# EAGLE board CPU68K_v3.2.1 (EAGLE 5.06)
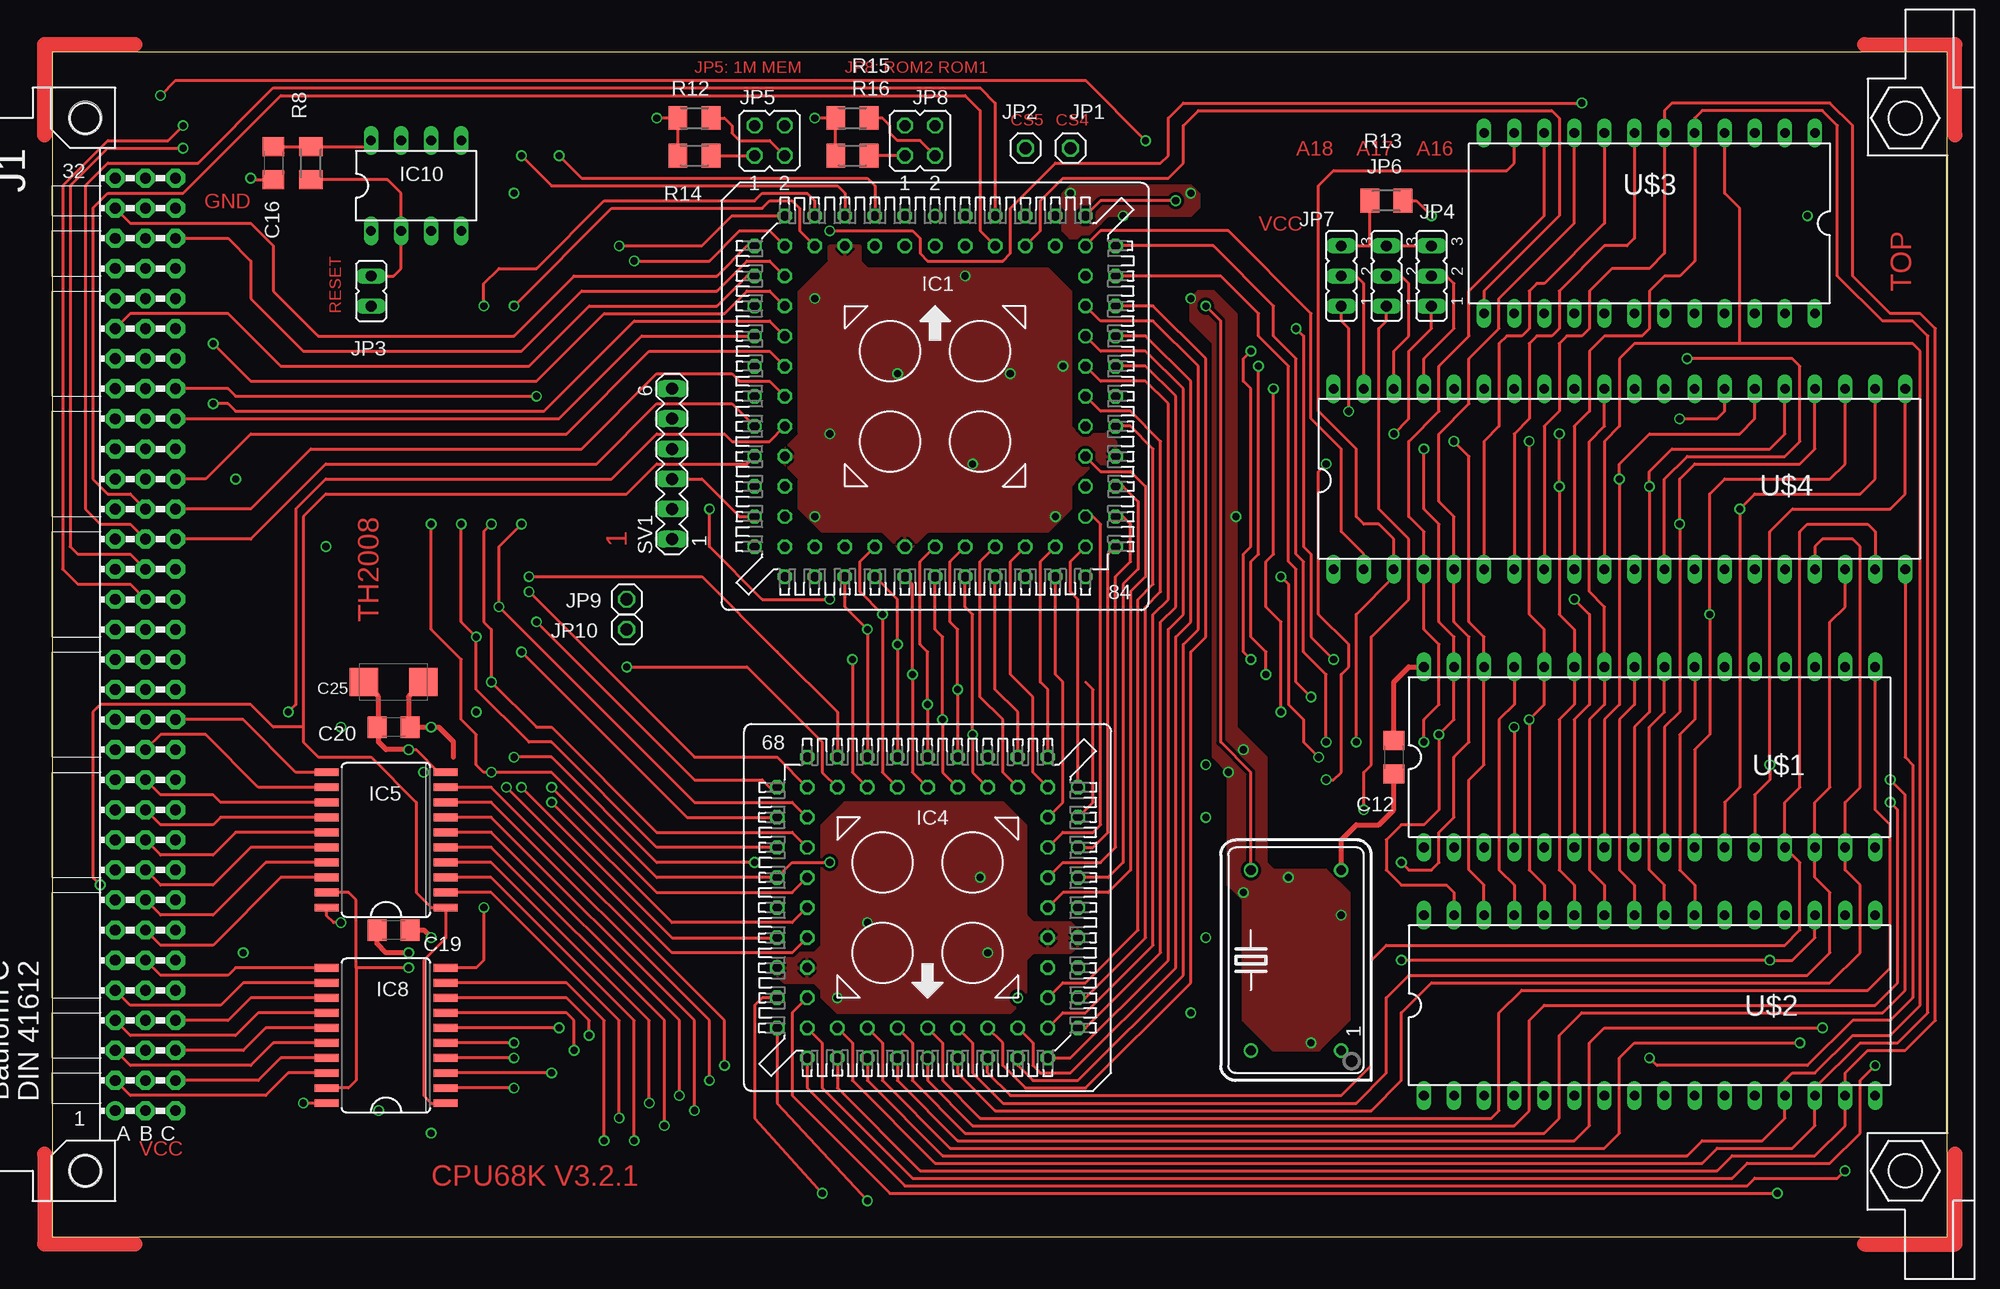
[diagram p1: board, top side]
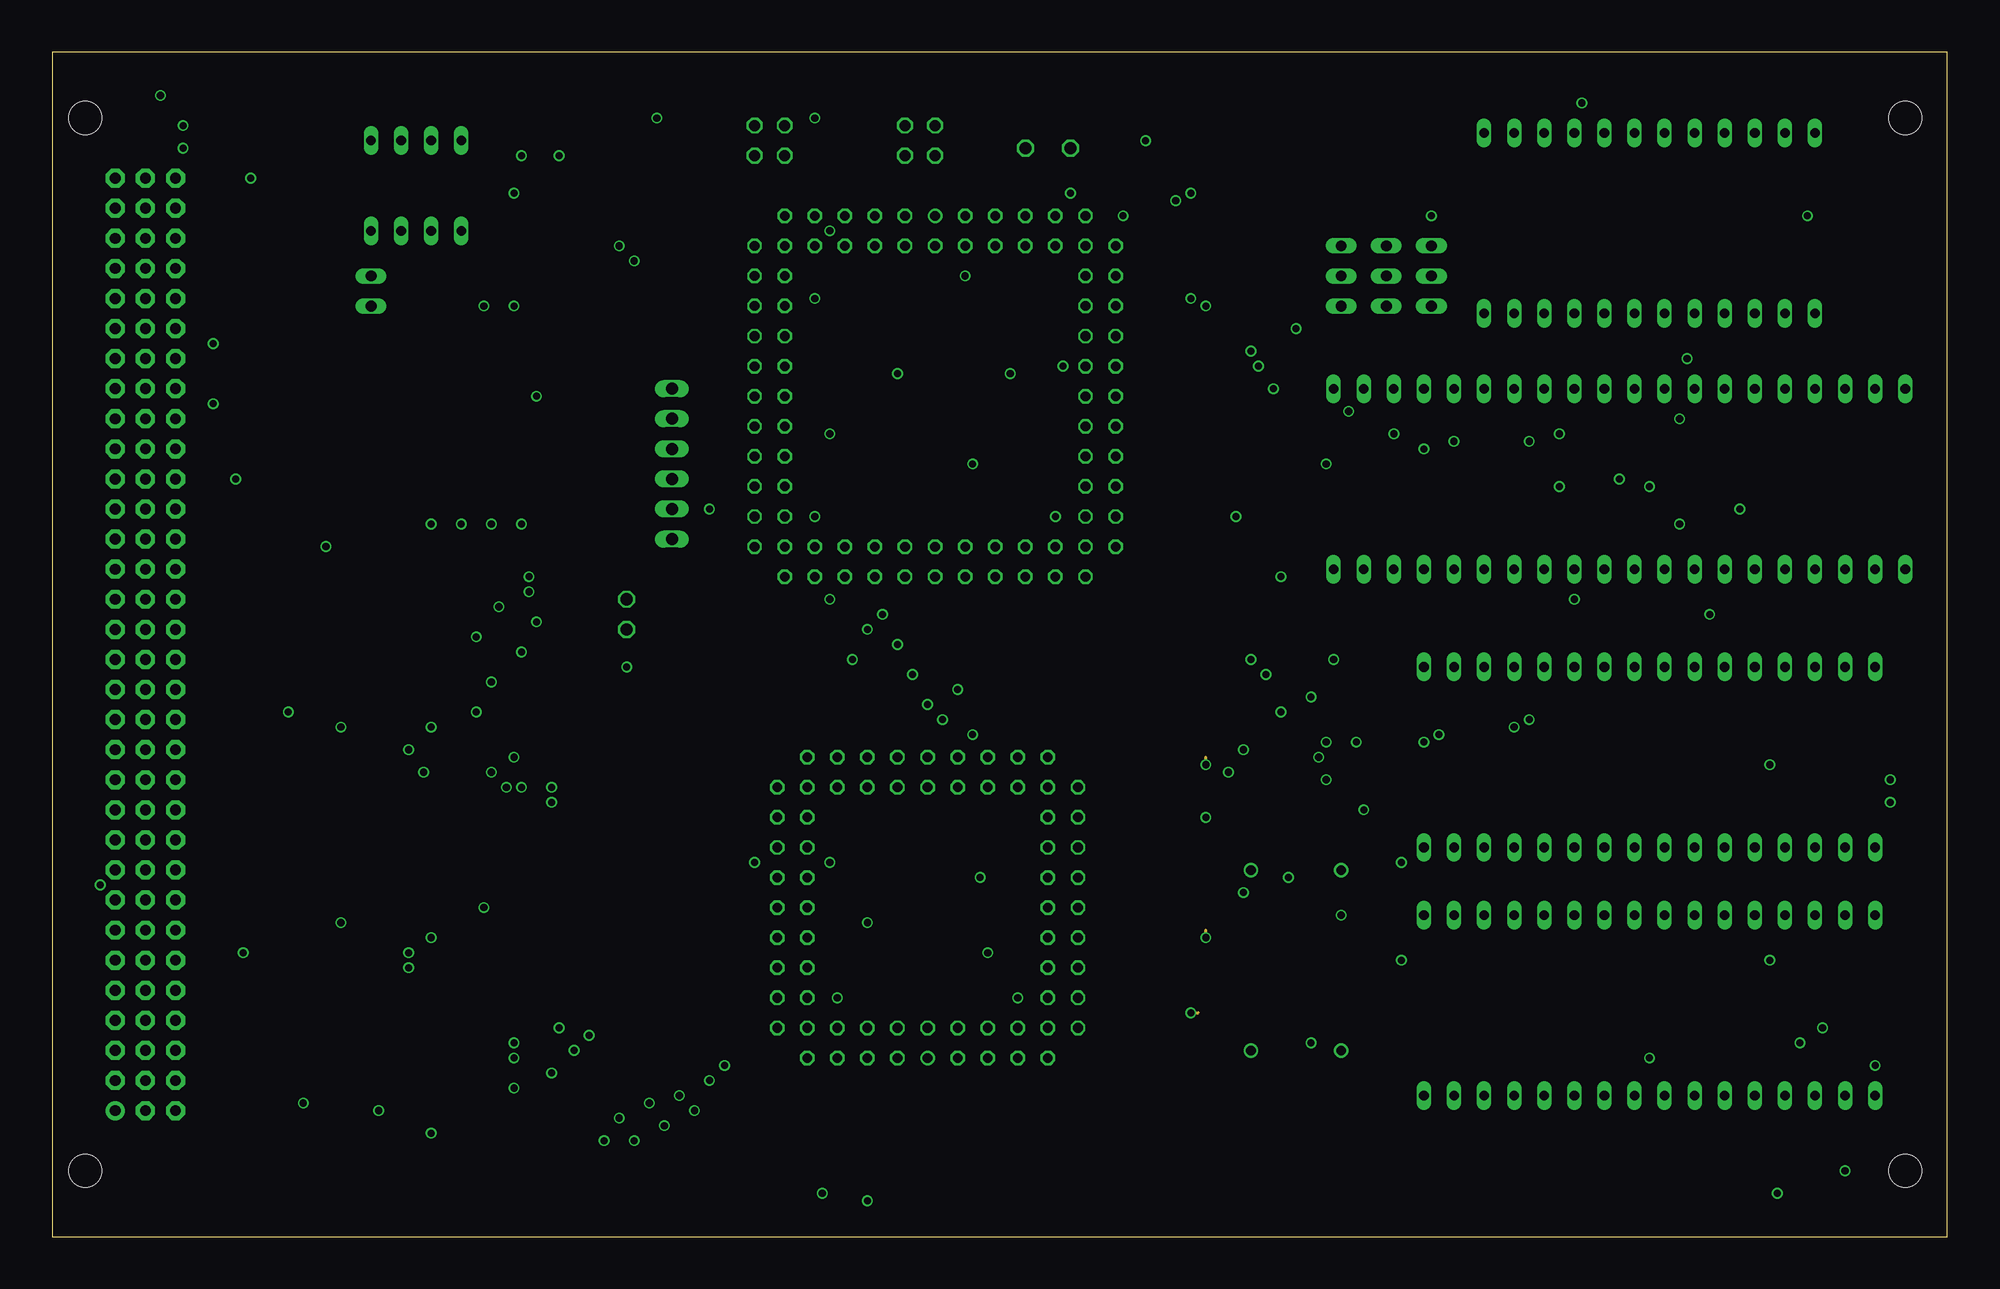
[diagram p2: board, inner layer $GND]
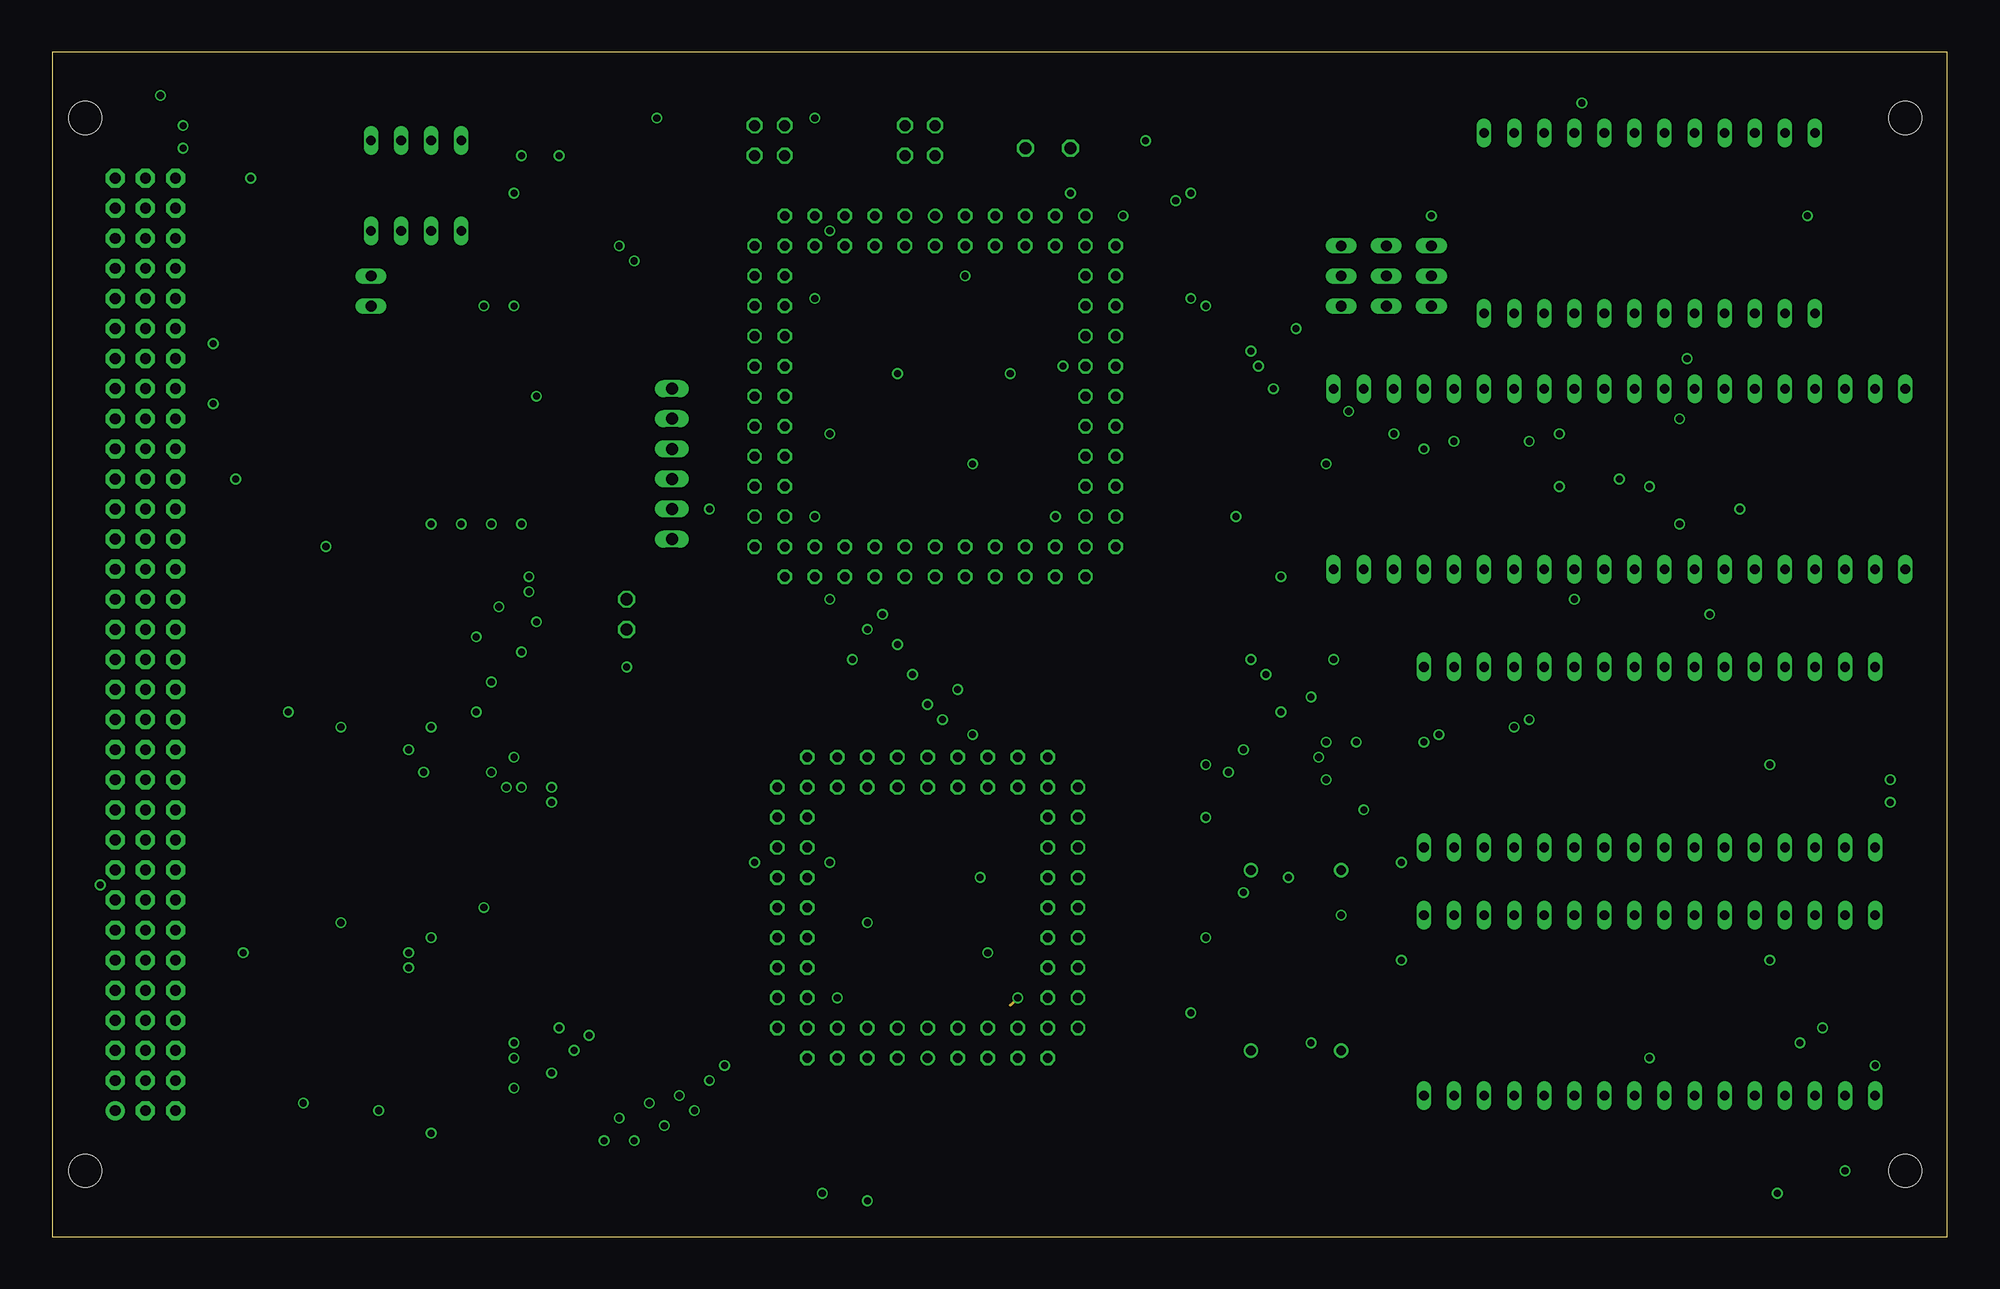
[diagram p3: board, inner layer $VCC]
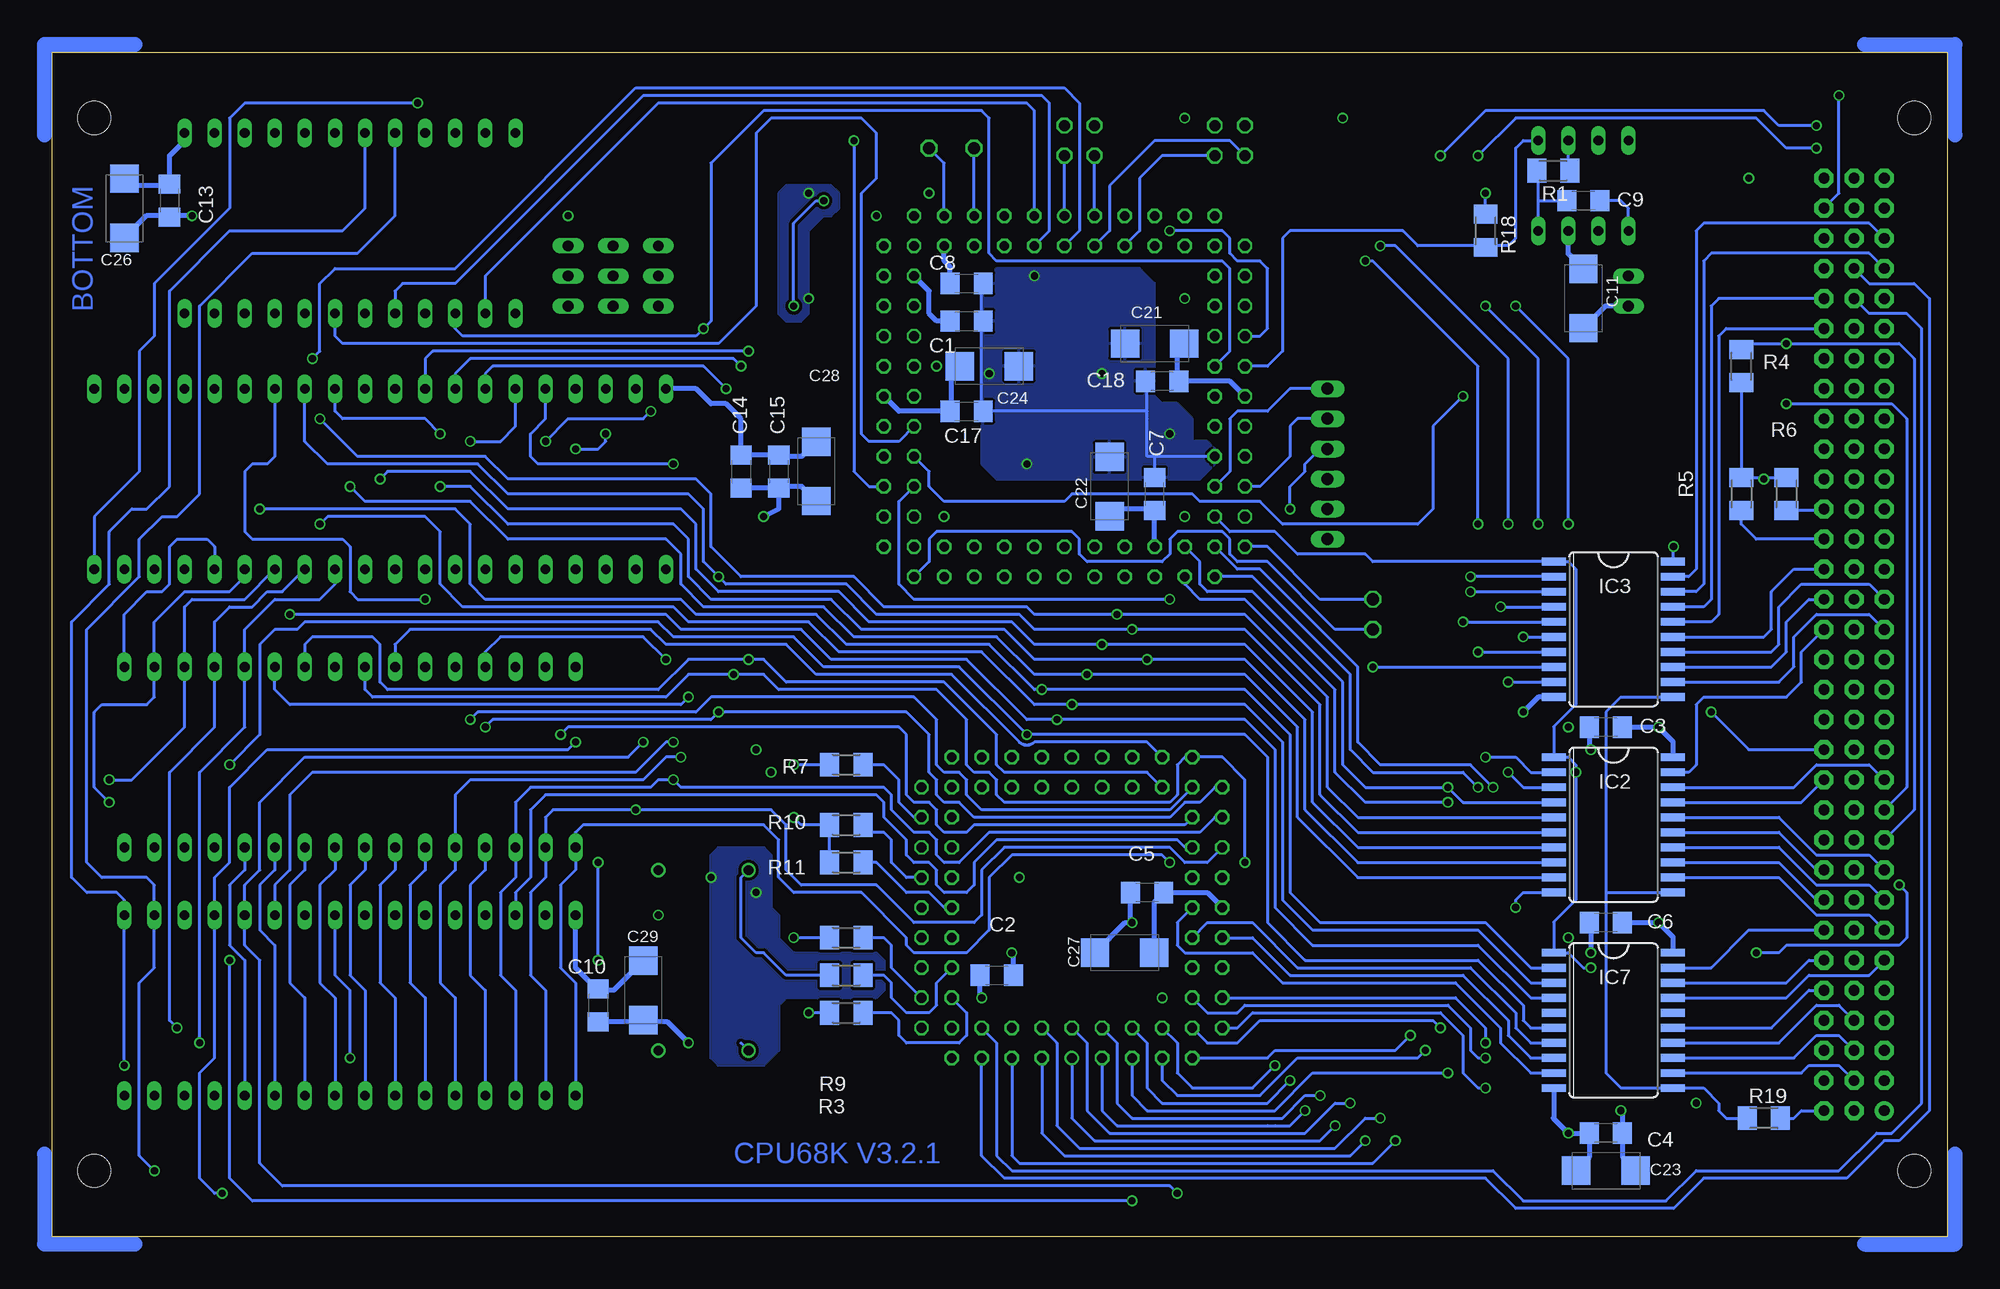
[diagram p4: board, bottom side, seen from below]

Size 160.02 x 100.03 mm. Coordinates in mm from the lower left corner, seen from the top.
Copper layers (1*2*3*16): Top 0.035mm / dielectric 1.5mm / $GND 0.035mm / dielectric 0.15mm / $VCC 0.035mm / dielectric 0.2mm / Bottom 0.035mm
Design rules "PCB-POOL": minimum track width 6mil, minimum drill 12mil, track to track 6mil, track to pad 6mil, pad to pad 6mil, via to via 6mil, smd to smd 6mil, copper to edge 20mil, drill to drill 8mil, minimum pad ring 8mil, minimum via ring 6mil, stop-mask expansion 3mil, vias tented up to drill 0mil, thermal gap 8mil

## Footprints (pad centres in the part's own frame; a part is rotated, then mirrored left to right if it is on the bottom)
C1206 = smd 1.6 x 1.8: 1 -1.4,0; 2 1.4,0
SMC_C = smd 2.4 x 2.4: + -2.5,0; - 2.5,0
S84 = drill 0.813 round: 1 0,15.24 | drill 0.813 octagon: 2 0,12.7; 3 -2.54,15.24; 4 -2.54,12.7; 5 -5.08,15.24; 6 -5.08,12.7; 7 -7.62,15.24; 8 -7.62,12.7; 9 -10.16,15.24; 10 -10.16,12.7; 11 -12.7,15.24; 12 -15.24,12.7; 13 -12.7,12.7; 14 -15.24,10.16; 15 -12.7,10.16; 16 -15.24,7.62; 17 -12.7,7.62; 18 -15.24,5.08; 19 -12.7,5.08; 20 -15.24,2.54; 21 -12.7,2.54; 22 -15.24,0; 23 -12.7,0; 24 -15.24,-2.54; 25 -12.7,-2.54; 26 -15.24,-5.08; 27 -12.7,-5.08; 28 -15.24,-7.62; 29 -12.7,-7.62; 30 -15.24,-10.16; 31 -12.7,-10.16; 32 -15.24,-12.7; 33 -12.7,-15.24; 34 -12.7,-12.7; 35 -10.16,-15.24; 36 -10.16,-12.7; 37 -7.62,-15.24; 38 -7.62,-12.7; 39 -5.08,-15.24; 40 -5.08,-12.7; 41 -2.54,-15.24; 42 -2.54,-12.7; 43 0,-15.24; 44 0,-12.7; 45 2.54,-15.24; 46 2.54,-12.7; 47 5.08,-15.24; 48 5.08,-12.7; 49 7.62,-15.24; 50 7.62,-12.7; 51 10.16,-15.24; 52 10.16,-12.7; 53 12.7,-15.24; 54 15.24,-12.7; 55 12.7,-12.7; 56 15.24,-10.16; 57 12.7,-10.16; 58 15.24,-7.62; 59 12.7,-7.62; 60 15.24,-5.08; 61 12.7,-5.08; 62 15.24,-2.54; 63 12.7,-2.54; 64 15.24,0; 65 12.7,0; 66 15.24,2.54; 67 12.7,2.54; 68 15.24,5.08; 69 12.7,5.08; 70 15.24,7.62; 71 12.7,7.62; 72 15.24,10.16; 73 12.7,10.16; 74 15.24,12.7; 75 12.7,15.24; 76 12.7,12.7; 77 10.16,15.24; 78 10.16,12.7; 79 7.62,15.24; 80 7.62,12.7; 81 5.08,15.24; 82 5.08,12.7; 83 2.54,15.24; 84 2.54,12.7
SO20W = smd 0.66 x 2.032: 1 -5.715,-5.029; 2 -4.445,-5.029; 3 -3.175,-5.029; 4 -1.905,-5.029; 5 -0.635,-5.029; 6 0.635,-5.029; 7 1.905,-5.029; 8 3.175,-5.029; 9 4.445,-5.029; 10 5.715,-5.029; 11 5.715,5.029; 12 4.445,5.029; 13 3.175,5.029; 14 1.905,5.029; 15 0.635,5.029; 16 -0.635,5.029; 17 -1.905,5.029; 18 -3.175,5.029; 19 -4.445,5.029; 20 -5.715,5.029
PLCC68-S = drill 0.813 round: 1 0,12.7 | drill 0.813 octagon: 2 0,10.16; 3 -2.54,12.7; 4 -2.54,10.16; 5 -5.08,12.7; 6 -5.08,10.16; 7 -7.62,12.7; 8 -7.62,10.16; 9 -10.16,12.7; 10 -12.7,10.16; 11 -10.16,10.16; 12 -12.7,7.62; 13 -10.16,7.62; 14 -12.7,5.08; 15 -10.16,5.08; 16 -12.7,2.54; 17 -10.16,2.54; 18 -12.7,0; 19 -10.16,0; 20 -12.7,-2.54; 21 -10.16,-2.54; 22 -12.7,-5.08; 23 -10.16,-5.08; 24 -12.7,-7.62; 25 -10.16,-7.62; 26 -12.7,-10.16; 27 -10.16,-12.7; 28 -10.16,-10.16; 29 -7.62,-12.7; 30 -7.62,-10.16; 31 -5.08,-12.7; 32 -5.08,-10.16; 33 -2.54,-12.7; 34 -2.54,-10.16; 35 0,-12.7; 36 0,-10.16; 37 2.54,-12.7; 38 2.54,-10.16; 39 5.08,-12.7; 40 5.08,-10.16; 41 7.62,-12.7; 42 7.62,-10.16; 43 10.16,-12.7; 44 12.7,-10.16; 45 10.16,-10.16; 46 12.7,-7.62; 47 10.16,-7.62; 48 12.7,-5.08; 49 10.16,-5.08; 50 12.7,-2.54; 51 10.16,-2.54; 52 12.7,0; 53 10.16,0; 54 12.7,2.54; 55 10.16,2.54; 56 12.7,5.08; 57 10.16,5.08; 58 12.7,7.62; 59 10.16,7.62; 60 12.7,10.16; 61 10.16,12.7; 62 10.16,10.16; 63 7.62,12.7; 64 7.62,10.16; 65 5.08,12.7; 66 5.08,10.16; 67 2.54,12.7; 68 2.54,10.16
DIL08 = drill 0.813 long: 1 -3.81,-3.81; 2 -1.27,-3.81; 3 1.27,-3.81; 4 3.81,-3.81; 5 3.81,3.81; 6 1.27,3.81; 7 -1.27,3.81; 8 -3.81,3.81
VG96P = drill 0.914 pad 1.6 round: A1 154.94,39.37 | drill 0.914 pad 1.6 octagon: A2 154.94,36.83; A3 154.94,34.29; A4 154.94,31.75; A5 154.94,29.21; A6 154.94,26.67; A7 154.94,24.13; A8 154.94,21.59; A9 154.94,19.05; A10 154.94,16.51; A11 154.94,13.97; A12 154.94,11.43; A13 154.94,8.89; A14 154.94,6.35; A15 154.94,3.81; A16 154.94,1.27; A17 154.94,-1.27; A18 154.94,-3.81; A19 154.94,-6.35; A20 154.94,-8.89; A21 154.94,-11.43; A22 154.94,-13.97; A23 154.94,-16.51; A24 154.94,-19.05; A25 154.94,-21.59; A26 154.94,-24.13; A27 154.94,-26.67; A28 154.94,-29.21; A29 154.94,-31.75; A30 154.94,-34.29; A31 154.94,-36.83; A32 154.94,-39.37; B1 152.4,39.37; B2 152.4,36.83; B3 152.4,34.29; B4 152.4,31.75; B5 152.4,29.21; B6 152.4,26.67; B7 152.4,24.13; B8 152.4,21.59; B9 152.4,19.05; B10 152.4,16.51; B11 152.4,13.97; B12 152.4,11.43; B13 152.4,8.89; B14 152.4,6.35; B15 152.4,3.81; B16 152.4,1.27; B17 152.4,-1.27; B18 152.4,-3.81; B19 152.4,-6.35; B20 152.4,-8.89; B21 152.4,-11.43; B22 152.4,-13.97; B23 152.4,-16.51; B24 152.4,-19.05; B25 152.4,-21.59; B26 152.4,-24.13; B27 152.4,-26.67; B28 152.4,-29.21; B29 152.4,-31.75; B30 152.4,-34.29; B31 152.4,-36.83; B32 152.4,-39.37; C1 149.86,39.37; C2 149.86,36.83; C3 149.86,34.29; C4 149.86,31.75; C5 149.86,29.21; C6 149.86,26.67; C7 149.86,24.13; C8 149.86,21.59; C9 149.86,19.05; C10 149.86,16.51; C11 149.86,13.97; C12 149.86,11.43; C13 149.86,8.89; C14 149.86,6.35; C15 149.86,3.81; C16 149.86,1.27; C17 149.86,-1.27; C18 149.86,-3.81; C19 149.86,-6.35; C20 149.86,-8.89; C21 149.86,-11.43; C22 149.86,-13.97; C23 149.86,-16.51; C24 149.86,-19.05; C25 149.86,-21.59; C26 149.86,-24.13; C27 149.86,-26.67; C28 149.86,-29.21; C29 149.86,-31.75; C30 149.86,-34.29; C31 149.86,-36.83; C32 149.86,-39.37 | hole 2.794: 3.81,44.45; 3.81,-44.45; 157.48,44.45; 157.48,-44.45
1X01 = drill 1.016 octagon: 1 0,0
JP1 = drill 0.914 long: 1 0,-1.27; 2 0,1.27
JP2 = drill 0.914 long: 1 -2.54,0; 2 0,0; 3 2.54,0
JP2Q = drill 0.914 octagon: 1 -1.27,-1.27; 2 -1.27,1.27; 3 1.27,-1.27; 4 1.27,1.27
DIL14S = drill 0.813 round: 1 -7.62,-3.81; 7 7.62,-3.81; 8 7.62,3.81; 14 -7.62,3.81
M1206 = smd 1.6 x 2: 1 -1.4,0; 2 1.4,0
MA06-1 = drill 1.016 long: 1 -6.35,0; 2 -3.81,0; 3 -1.27,0; 4 1.27,0; 5 3.81,0; 6 6.35,0
DIL32 = drill 0.813 long: 1 -19.05,-7.62; 2 -16.51,-7.62; 3 -13.97,-7.62; 4 -11.43,-7.62; 5 -8.89,-7.62; 6 -6.35,-7.62; 7 -3.81,-7.62; 8 -1.27,-7.62; 9 1.27,-7.62; 10 3.81,-7.62; 11 6.35,-7.62; 12 8.89,-7.62; 13 11.43,-7.62; 14 13.97,-7.62; 15 16.51,-7.62; 16 19.05,-7.62; 17 19.05,7.62; 18 16.51,7.62; 19 13.97,7.62; 20 11.43,7.62; 21 8.89,7.62; 22 6.35,7.62; 23 3.81,7.62; 24 1.27,7.62; 25 -1.27,7.62; 26 -3.81,7.62; 27 -6.35,7.62; 28 -8.89,7.62; 29 -11.43,7.62; 30 -13.97,7.62; 31 -16.51,7.62; 32 -19.05,7.62
DIL24 = drill 0.813 long: 1 -13.97,-7.62; 2 -11.43,-7.62; 3 -8.89,-7.62; 4 -6.35,-7.62; 5 -3.81,-7.62; 6 -1.27,-7.62; 7 1.27,-7.62; 8 3.81,-7.62; 9 6.35,-7.62; 10 8.89,-7.62; 11 11.43,-7.62; 12 13.97,-7.62; 13 13.97,7.62; 14 11.43,7.62; 15 8.89,7.62; 16 6.35,7.62; 17 3.81,7.62; 18 1.27,7.62; 19 -1.27,7.62; 20 -3.81,7.62; 21 -6.35,7.62; 22 -8.89,7.62; 23 -11.43,7.62; 24 -13.97,7.62
DIL40 = drill 0.813 long: 1 -24.13,-7.62; 2 -21.59,-7.62; 3 -19.05,-7.62; 4 -16.51,-7.62; 5 -13.97,-7.62; 6 -11.43,-7.62; 7 -8.89,-7.62; 8 -6.35,-7.62; 9 -3.81,-7.62; 10 -1.27,-7.62; 11 1.27,-7.62; 12 3.81,-7.62; 13 6.35,-7.62; 14 8.89,-7.62; 15 11.43,-7.62; 16 13.97,-7.62; 17 16.51,-7.62; 18 19.05,-7.62; 19 21.59,-7.62; 20 24.13,-7.62; 21 24.13,7.62; 22 21.59,7.62; 23 19.05,7.62; 24 16.51,7.62; 25 13.97,7.62; 26 11.43,7.62; 27 8.89,7.62; 28 6.35,7.62; 29 3.81,7.62; 30 1.27,7.62; 31 -1.27,7.62; 32 -3.81,7.62; 33 -6.35,7.62; 34 -8.89,7.62; 35 -11.43,7.62; 36 -13.97,7.62; 37 -16.51,7.62; 38 -19.05,7.62; 39 -21.59,7.62; 40 -24.13,7.62

## Placement (x,y rotation side)
C1  100n  [C1206]  82.8,77.32 0 bottom
C2  100n  [C1206]  80.26,22.07 0 bottom
C3  100n  [C1206]  28.83,43.03 180 bottom
C4  100n  [C1206]  28.83,8.74 180 bottom
C5  100n  [C1206]  67.56,29.06 180 bottom
C6  100n  [C1206]  28.83,26.52 180 bottom
C7  100n  [C1206]  66.93,62.71 90 bottom
C8  100n  [C1206]  82.8,80.49 0 bottom
C9  100n  [C1206]  30.73,87.48 180 bottom
C10  100n  [C1206]  113.92,19.53 270 bottom
C11  10µ/16  [SMC_C]  30.73,79.22 270 bottom
C12  100n  [C1206]  113.28,40.49 270 top
C13  100n  [C1206]  150.11,87.48 270 bottom
C14  100n  [C1206]  101.85,64.62 270 bottom
C15  100n  [C1206]  98.68,64.62 270 bottom
C16  100n  [C1206]  18.67,90.65 270 top
C17  100n  [C1206]  82.8,69.7 0 bottom
C18  100n  [C1206]  66.29,72.24 180 bottom
C19  100n  [C1206]  28.83,25.88 180 top
C20  100n  [C1206]  28.83,43.03 180 top
C21  10µ/16  [SMC_C]  66.93,75.41 180 bottom
C22  10µ/16  [SMC_C]  70.74,63.35 90 bottom
C23  10µ/16  [SMC_C]  28.83,5.56 180 bottom
C24  10µ/16  [SMC_C]  80.9,73.51 0 bottom
C25  10µ/16  [SMC_C]  28.83,46.84 180 top
C26  10µ/16  [SMC_C]  153.92,86.84 270 bottom
C27  10µ/16  [SMC_C]  69.47,23.98 180 bottom
C28  10µ/16  [SMC_C]  95.5,64.62 270 bottom
C29  10µ/16  [SMC_C]  110.11,20.8 270 bottom
IC1  XC9572PLCC84  [S84]  74.55,70.97 0 top
IC2  74HCT573D  [SO20W]  28.19,34.77 270 bottom
IC3  74HCT573D  [SO20W]  28.19,51.28 270 bottom
IC4  MC68HC001  [PLCC68-S]  73.91,27.79 180 top
IC5  74HCT245DW  [SO20W]  28.19,33.5 90 top
IC7  74HCT573D  [SO20W]  28.19,18.26 270 bottom
IC8  74HCT245DW  [SO20W]  28.19,16.99 90 top
IC10  TLC7725D  [DIL08]  30.73,88.75 0 top
J1  [VG96P]  160.27,50.01 180 top
JP1  [1X01]  85.98,91.92 0 top
JP2  [1X01]  82.17,91.92 0 top
JP3  RESET  [JP1]  26.92,79.86 0 top
JP4  [JP2]  116.46,81.13 90 top
JP5  [JP2Q]  60.58,92.56 0 top
JP6  [JP2]  112.65,81.13 90 top
JP7  [JP2]  108.84,81.13 90 top
JP8  [JP2Q]  73.28,92.56 0 top
JP9  [1X01]  48.51,53.82 0 top
JP10  [1X01]  48.51,51.28 0 top
QG1  [DIL14S]  105.03,23.34 90 top
R1  10k  [M1206]  33.27,90.02 180 bottom
R2  4k7  [M1206]  92.96,25.25 180 bottom
R3  4k7  [M1206]  92.96,18.9 180 bottom
R4  10k  [M1206]  17.4,73.51 270 bottom
R5  10k  [M1206]  17.4,62.71 90 bottom
R6  10k  [M1206]  13.59,62.71 90 bottom
R7  4k7  [M1206]  92.96,39.85 180 bottom
R8  10k  [M1206]  21.84,90.65 270 top
R9  47  [M1206]  92.96,22.07 180 bottom
R10  4k7  [M1206]  92.96,34.77 180 bottom
R11  3K3  [M1206]  92.96,31.6 180 bottom
R12  10k  [M1206]  54.23,94.46 180 top
R13  10k  [M1206]  112.65,87.48 0 top
R14  10k  [M1206]  54.23,91.29 180 top
R15  10k  [M1206]  67.56,94.46 180 top
R16  10k  [M1206]  67.56,91.29 180 top
R18  10k  [M1206]  38.99,84.94 270 bottom
R19  10k  [M1206]  15.49,10.01 0 bottom
SV1  [MA06-1]  52.32,65.25 90 top
U$1  628512PDIL32  [DIL32]  134.87,40.49 0 top
U$2  628512PDIL32  [DIL32]  134.87,19.53 0 top
U$3  DS12C887DIL24  [DIL24]  134.87,85.57 180 top
U$4  27C4002DIL40  [DIL40]  132.33,63.98 0 top

## Tracks (layer width: path | path; a pad name or v marks a point on that pad's centre or on a via)
1M
  Top 0.254: R14.1 JP5.1
  Bottom 0.254: JP5.1 60.58,92.56 66.93,92.56 70.74,88.75 70.74,84.94 IC1.4
/AS
  Top 0.254: IC4.6 80.26,16.36 80.26,14.45 82.17,12.55 87.25,12.55 96.14,21.44 96.14,49.38 97.41,50.65 97.41,74.14 92.96,78.59 IC1.70
/BERR
  Top 0.254: IC4.24 87.88,36.68 87.88,46.2 87.25,46.84
  Bottom 0.254: IC4.24 87.25,35.41 88.52,36.68 88.52,38.58 89.79,39.85 R7.1
/BG
  Top 0.254: IC4.11 85.34,18.9 87.25,18.9 92.96,24.61 92.96,52.55 94.23,53.82 94.23,70.33 92.33,72.24 88.52,72.24 IC1.67
/BGACK
  Top 0.254: IC4.12 87.25,20.17 92.33,25.25 92.33,53.19 93.6,54.46 93.6,67.16 91.06,69.7 88.52,69.7 IC1.65
  Bottom 0.254: R2.1 89.79,25.25 89.15,24.61 89.15,22.71 IC4.12
/BR
  Top 0.254: IC4.13 85.34,21.44 87.25,21.44 91.69,25.88 91.69,53.82 92.96,55.09 92.96,66.52 91.06,68.43 IC1.62
  Bottom 0.254: IC4.13 82.8,18.9 82.8,16.99 83.44,16.36 87.88,16.36 88.52,16.99 88.52,18.26 89.15,18.9 R3.1 91.69,18.9
/BUSACK
  Top 0.254: J1.A31 6.6,85.57 16.76,85.57 18.67,83.67 18.67,79.86 22.48,76.05 38.99,76.05 44.07,81.13 56.13,81.13 58.67,83.67 IC1.12
/BUSRQ  (via drill 0.6)
  Top 0.254: v13.59,70.33 14.86,70.33 15.49,69.7 41.53,69.7 49.15,77.32 60.58,77.32 IC1.19
  Bottom 0.254: J1.A11 3.43,37.95 3.43,69.06 4.7,70.33 v13.59,70.33
/CS1
  Top 0.254: U$4.2 110.74,57.63 108.84,59.54 108.84,66.52 106.3,69.06 106.3,77.95 99.31,84.94 88.52,84.94 IC1.76
/CS2  (via drill 0.6)
  Top 0.254: v106.3,45.57 105.03,46.84 105.03,56.36 104.39,57 104.39,73.51 101.85,76.05 101.85,77.95 98.68,81.13 IC1.72
  Bottom 0.254: U$1.22 141.22,46.2 139.95,44.93 106.93,44.93 v106.3,45.57
/CS3  (via drill 0.6)
  Top 0.254: v107.57,41.76 107.57,47.47 105.66,49.38 105.66,57 105.03,57.63 105.03,74.14 103.12,76.05 103.12,78.59 98.04,83.67 IC1.74
  Bottom 0.254: U$2.22 141.22,29.69 139.95,30.96 139.95,37.31 138.05,39.22 110.74,39.22 108.2,41.76 v107.57,41.76
/CS4
  Bottom 0.254: JP1.1 84.71,90.65 IC1.77
/CS5
  Bottom 0.254: IC1.79 JP2.1
/CS6
  Top 0.254: U$3.13 120.9,79.86 127.25,86.21 127.25,94.46 126.62,95.1 96.77,95.1 95.5,93.83 95.5,90.65 94.23,89.38 85.34,89.38 83.44,87.48 83.44,84.94 IC1.80
/CS7
  Bottom 0.254: IC1.53 85.98,57 85.98,58.9 85.34,59.54 73.91,59.54 73.28,58.9 73.28,57.63 72.64,57 66.29,57 65.66,57.63 65.66,58.9 65.02,59.54 61.21,59.54 60.58,58.9 60.58,57.63 59.94,57 57.4,57 51.69,51.28 JP10.1
/CS8
  Bottom 0.254: IC1.32 57.4,58.27 52.96,53.82 JP9.1
/DTACK
  Top 0.254: IC4.10 87.25,17.63 93.6,23.98 93.6,51.92 94.87,53.19 94.87,70.97 92.33,73.51 IC1.66
/HALT  (via drill 0.6)
  Top 0.254: IC4.19 85.34,29.06 89.15,29.06 91.06,30.96 91.06,54.46 92.33,55.73 92.33,63.35 91.06,64.62 88.52,64.62 IC1.61 | J1.C25 14.86,71.6 15.49,70.97 v40.89,70.97
  Bottom 0.254: R11.1 90.42,31.6 87.88,29.06 85.98,29.06 84.71,27.79 IC4.19 | IC1.61 85.98,64.62 85.98,63.35 84.71,62.08 74.55,62.08 73.91,62.71 63.75,62.71 63.12,62.08 58.04,62.08 56.13,60.17 44.7,60.17 43.43,61.44 43.43,68.43 v40.89,70.97
/INT
  Top 0.254: J1.C21 16.76,61.44 21.84,66.52 44.7,66.52 51.05,72.87 57.4,72.87 58.04,72.24 60.58,72.24 IC1.23
  Bottom 0.254: R6.1 10.54,61.31 J1.C21
/IPL0
  Top 0.254: IC4.27 84.07,46.2 83.44,46.84 83.44,57 IC1.52
/IPL1
  Top 0.254: IC4.26 86.61,53.82 85.98,54.46 85.98,57 IC1.55
/IPL2
  Top 0.254: IC4.25 85.34,36.68 85.34,46.84 84.71,47.47 IC1.51
/LDS
  Top 0.254: IC4.8 82.8,16.36 82.8,14.45 83.44,13.82 85.98,13.82 94.87,22.71 94.87,50.65 96.14,51.92 96.14,72.24 92.33,76.05 IC1.68
  Bottom 0.254: IC4.8 80.26,16.36 80.26,6.83 78.99,5.56 38.35,5.56 35.81,3.02 23.75,3.02 21.21,5.56 9.14,5.56 5.97,8.74 4.7,8.74 2.16,11.28 2.16,76.68 3.43,77.95 6.6,77.95 J1.B28
/NMI
  Top 0.254: J1.C20 16.76,58.9 23.11,65.25 45.97,65.25 51.05,70.33 57.4,70.33 IC1.24
  Bottom 0.254: R5.1 17.4,60.17 16.13,58.9 J1.C20
/RES
  Bottom 0.254: IC10.5 35.81,92.56 36.45,91.92 36.45,84.3 37.08,83.67 38.99,83.67 44.7,83.67 45.97,84.94 55.5,84.94 56.13,84.3 56.13,74.78 57.4,73.51 IC1.20
  Bottom 0.406: 38.99,83.67 R18.2
/RESET  (via drill 0.6)
  Top 0.254: IC4.20 89.15,30.33 90.42,31.6 90.42,55.09 91.69,56.36 91.69,62.08 90.42,63.35 IC1.58 | v9.14,96.37 10.41,97.64 87.25,97.64 v92.33,92.56
  Bottom 0.254: IC4.20 87.88,30.33 89.15,31.6 89.15,33.5 89.79,34.14 91.06,34.14 91.69,35.41 R10.1 | J1.C31 9.14,88.11 v9.14,96.37 | v92.33,92.56 92.33,64.62 91.06,63.35 IC1.58
/RTC_INT
  Bottom 0.254: IC1.63 88.52,67.16 91.06,67.16 91.69,67.79 91.69,88.11 90.42,89.38 90.42,93.19 91.69,94.46 99.31,94.46 100.58,93.19 100.58,78.59 103.76,75.41 135.51,75.41 136.14,76.05 U$3.19
/UDS
  Top 0.254: IC4.7 81.53,14.45 82.8,13.18 86.61,13.18 95.5,22.07 95.5,50.01 96.77,51.28 96.77,73.51 92.96,77.32 88.52,77.32 IC1.71
  Bottom 0.254: IC4.7 81.53,6.83 79.63,4.93 38.99,4.93 36.45,2.39 23.11,2.39 20.57,4.93 8.51,4.93 5.33,8.1 4.06,8.1 1.52,10.64 1.52,79.22 2.79,80.49 6.6,80.49 J1.B29
/VMA
  Top 0.254: IC4.21 85.34,31.6 88.52,31.6 89.79,32.87 89.79,55.73 91.06,57 91.06,60.17 90.42,60.81 IC1.56
/VPA
  Top 0.254: IC4.23 85.34,34.14 87.88,34.14 88.52,34.77 88.52,60.17 87.88,60.81 IC1.57
/WAIT  (via drill 0.6)
  Top 0.254: v13.59,75.41 16.76,72.24 40.89,72.24 46.61,77.95 56.77,77.95 58.67,79.86 60.58,79.86 IC1.17
  Bottom 0.254: J1.A10 2.79,36.04 2.79,74.14 4.06,75.41 v13.59,75.41 17.4,75.41 R4.1
A1  (via drill 0.6)
  Top 0.254: IC1.45 77.09,53.19 77.72,52.55 v77.72,42.39 77.72,39.22 IC4.32 | U$4.21 156.46,62.71 155.19,61.44 146.94,61.44 145.03,59.54 v145.03,39.85 145.03,38.58 143.76,37.31 U$1.12
  Bottom 0.254: U$2.12 143.76,23.34 145.03,24.61 145.03,29.69 143.76,30.96 U$1.12 | v145.03,39.85 142.49,42.39 142.49,50.01 141.22,51.28 139.32,51.28 138.68,51.92 108.84,51.92 107.57,50.65 97.41,50.65 94.87,48.11 83.44,48.11 v77.72,42.39 59.31,42.39 57.4,40.49 57.4,26.52 54.23,23.34 39.62,23.34 35.81,19.53 35.81,18.26 35.18,17.63 IC7.6
A2  (via drill 0.6)
  Top 0.254: IC4.33 v76.45,46.2 76.45,51.28 75.82,51.92 75.82,57 IC1.46 | U$4.22 153.92,63.98 152.65,62.71 143.76,62.71 v142.49,61.44 142.49,37.95 141.22,36.68 U$1.11
  Bottom 0.254: U$2.11 141.22,24.61 142.49,25.88 142.49,29.69 141.22,30.96 U$1.11 | v142.49,61.44 125.98,61.44 124.71,60.17 124.71,55.09 123.44,53.82 106.93,53.82 105.66,52.55 95.5,52.55 92.96,50.01 80.9,50.01 77.09,46.2 v76.45,46.2 59.31,46.2 55.5,42.39 55.5,29.06 52.96,26.52 38.99,26.52 35.18,22.71 IC7.2
A3  (via drill 0.6)
  Top 0.254: IC1.43 74.55,51.28 75.18,50.65 v75.18,43.66 75.18,39.22 IC4.34 | U$4.23 151.38,65.25 150.11,63.98 141.22,63.98 139.95,62.71 v139.95,52.55 139.95,42.39 138.68,41.12 U$1.10
  Bottom 0.254: U$2.10 138.68,20.17 139.95,21.44 139.95,29.69 138.68,30.96 U$1.10 | v139.95,52.55 108.2,52.55 106.93,51.28 96.77,51.28 94.23,48.74 82.8,48.74 77.72,43.66 v75.18,43.66 59.31,43.66 56.77,41.12 56.77,27.79 53.59,24.61 39.62,24.61 35.18,20.17 IC7.4
A4  (via drill 0.6)
  Top 0.254: IC4.35 v73.91,44.93 73.91,49.38 73.28,50.01 73.28,57 IC1.44 | U$4.24 148.84,66.52 147.57,65.25 138.68,65.25 137.41,63.98 v137.41,60.17 137.41,44.3 136.14,43.03 U$1.9
  Bottom 0.254: U$2.9 136.14,20.17 137.41,21.44 137.41,29.69 136.14,30.96 U$1.9 | v137.41,60.17 136.78,60.81 128.52,60.81 127.25,59.54 127.25,55.09 125.35,53.19 107.57,53.19 106.3,51.92 96.14,51.92 93.6,49.38 81.53,49.38 77.09,44.93 v73.91,44.93 59.31,44.93 56.13,41.76 56.13,28.42 53.59,25.88 39.62,25.88 35.18,21.44 IC7.3
A5  (via drill 0.6)
  Top 0.254: IC1.41 72.64,55.09 v72.64,47.47 72.64,39.22 IC4.36 | U$4.25 146.3,67.79 145.03,66.52 136.78,66.52 134.87,64.62 v134.87,63.35 134.87,44.3 133.6,43.03 U$1.8
  Bottom 0.254: U$2.8 133.6,20.8 134.87,22.07 134.87,29.69 133.6,30.96 U$1.8 | v134.87,63.35 133.6,62.08 124.71,62.08 121.54,58.9 108.2,58.9 106.93,57.63 106.93,55.09 105.03,53.19 94.87,53.19 92.33,50.65 80.26,50.65 77.09,47.47 v72.64,47.47 59.31,47.47 54.86,43.03 54.86,35.41 49.78,30.33 IC2.9
A6  (via drill 0.6)
  Top 0.254: IC4.37 v71.37,50.01 71.37,53.82 IC1.39 | U$1.7 131.06,43.66 132.33,44.93 v132.33,63.98 132.33,65.25 134.87,67.79 142.49,67.79 143.76,69.06 U$4.26
  Bottom 0.254: U$2.7 131.06,20.17 132.33,21.44 132.33,29.69 131.06,30.96 U$1.7 | v132.33,63.98 131.7,64.62 124.71,64.62 121.54,61.44 106.93,61.44 105.66,60.17 105.66,56.36 103.76,54.46 93.6,54.46 91.06,51.92 78.99,51.92 77.09,50.01 v71.37,50.01 59.31,50.01 53.59,44.3 53.59,36.68 49.78,32.87 IC2.7
A7  (via drill 0.6)
  Top 0.254: IC1.40 68.2,57 68.2,54.46 v70.1,52.55 70.1,39.22 IC4.38 | v137.41,69.06 140.59,69.06 141.22,69.7 U$4.27 | U$1.6 128.52,43.66 129.79,44.93 129.79,52.55 v128.52,53.82
  Bottom 0.254: U$2.6 128.52,20.17 129.79,21.44 129.79,29.69 128.52,30.96 U$1.6 | v137.41,69.06 134.24,65.89 123.44,65.89 121.54,63.98 105.66,63.98 104.39,62.71 104.39,58.27 101.85,55.73 92.33,55.73 89.79,53.19 77.72,53.19 77.09,52.55 v70.1,52.55 59.31,52.55 52.32,45.57 52.32,37.95 49.78,35.41 IC2.5 | v128.52,53.82 134.24,53.82 134.87,54.46 134.87,58.27 135.51,58.9 143.13,58.9 143.76,59.54 143.76,64.62 143.13,65.25 141.86,65.25 141.22,65.89 U$4.27
A8  (via drill 0.6)
  Top 0.254: IC4.39 v68.83,51.28 66.93,53.19 IC1.37 | v103.76,55.73 104.39,55.09 104.39,44.93 105.66,43.66 105.66,41.76 v106.93,40.49
  Bottom 0.254: U$2.5 125.98,20.17 127.25,21.44 127.25,29.69 125.98,30.96 U$1.5 125.98,37.31 124.71,38.58 110.11,38.58 108.2,40.49 v106.93,40.49 | U$4.28 138.68,67.16 136.78,65.25 124.08,65.25 121.54,62.71 106.3,62.71 105.03,61.44 105.03,57 v103.76,55.73 103.12,55.09 92.96,55.09 90.42,52.55 78.36,52.55 77.09,51.28 v68.83,51.28 59.31,51.28 52.96,44.93 52.96,37.31 49.78,34.14 IC2.6
A9  (via drill 0.6)
  Top 0.254: IC4.40 67.56,39.22 v67.56,48.74 | U$2.27 128.52,29.69 127.25,30.96 127.25,43.66 128.52,44.93 U$1.27 128.52,51.28 127.25,52.55 v127.25,63.35 v127.25,67.79
  Bottom 0.254: v127.25,63.35 124.71,63.35 121.54,60.17 107.57,60.17 106.3,58.9 106.3,55.73 104.39,53.82 94.23,53.82 91.69,51.28 79.63,51.28 77.09,48.74 v67.56,48.74 59.31,48.74 54.23,43.66 54.23,36.04 49.78,31.6 IC2.8 | v127.25,67.79 128.52,69.06 135.51,69.06 136.14,69.7 U$4.29
A10  (via drill 0.6)
  Top 0.254: v40.26,55.73 54.86,55.73 61.21,49.38 66.29,44.3 IC4.41 | U$2.26 131.06,29.69 129.79,30.96 129.79,43.66 131.06,44.93 U$1.26 131.06,53.19 129.79,54.46 129.79,67.16 131.06,68.43 U$4.31
  Bottom 0.254: IC4.41 67.56,41.76 77.09,41.76 arc90 78.36,41.76 84.07,47.47 95.5,47.47 98.04,50.01 108.2,50.01 109.47,51.28 129.79,51.28 131.06,50.01 U$1.26 | IC3.2 v40.26,55.73
A11  (via drill 0.6)
  Top 0.254: IC4.42 65.02,39.22 65.02,41.76 58.67,48.11 v48.51,48.11 | U$2.23 138.68,29.69 137.41,30.96 137.41,42.39 138.68,43.66 U$1.23 | v101.22,48.74 100.58,49.38 100.58,57.63 101.22,58.27 101.22,71.6 100.58,72.24 100.58,74.14 v101.22,74.78
  Bottom 0.254: IC4.42 67.56,39.22 79.63,39.22 80.26,39.85 80.26,42.39 84.71,46.84 98.04,46.84 99.95,48.74 v101.22,48.74 106.3,48.74 108.84,46.2 131.7,46.2 132.33,46.84 132.33,50.01 132.97,50.65 138.05,50.65 138.68,50.01 U$1.23 | v101.22,74.78 127.89,74.78 128.52,74.14 U$4.32 | v48.51,48.11 IC3.8
A12  (via drill 0.6)
  Top 0.254: v38.99,40.49 42.16,40.49 51.05,31.6 v59.31,31.6 | U$2.25 133.6,29.69 132.33,30.96 132.33,43.66 133.6,44.93 U$1.25 | v102.49,47.47 102.49,49.38 101.22,50.65 101.22,57 101.85,57.63 v101.85,73.51
  Bottom 0.254: v38.99,40.49 36.45,40.49 35.18,39.22 IC2.2 | v59.31,31.6 59.31,38.58 61.21,40.49 IC4.43 64.39,40.49 65.02,39.85 65.02,37.31 65.66,36.68 79.63,36.68 80.26,37.31 80.26,38.58 80.9,39.22 82.17,39.22 82.8,39.85 82.8,43.66 85.34,46.2 98.68,46.2 99.95,47.47 v102.49,47.47 106.3,47.47 108.2,45.57 132.97,45.57 133.6,46.2 U$1.25 | U$4.33 125.98,72.87 124.71,74.14 102.49,74.14 v101.85,73.51
A13  (via drill 0.6)
  Top 0.254: IC4.44 60.58,37.95 59.94,38.58 54.23,38.58 v40.89,51.92 | v123.44,43.03 U$1.4 | v103.76,44.3 103.76,51.92 102.49,53.19 102.49,57 103.12,57.63 v103.12,71.6
  Bottom 0.254: IC4.44 61.85,37.95 63.12,36.68 64.39,36.68 65.66,35.41 82.17,35.41 83.44,36.68 84.71,36.68 85.34,37.31 85.34,38.58 85.98,39.22 85.98,42.39 87.88,44.3 v103.76,44.3 104.39,43.66 122.81,43.66 v123.44,43.03 | U$2.4 123.44,20.8 124.71,22.07 124.71,29.69 123.44,30.96 U$1.4 | U$4.34 123.44,72.87 122.81,73.51 105.03,73.51 v103.12,71.6 | v40.89,51.92 IC3.5
A14  (via drill 0.6)
  Top 0.254: IC4.45 61.21,40.49 54.23,40.49 v40.26,54.46 | U$2.28 125.98,29.69 124.71,30.96 v124.71,43.66 125.98,44.93 U$1.28 125.98,51.28 124.71,52.55 v124.71,67.16
  Bottom 0.254: IC4.45 65.66,36.04 81.53,36.04 82.8,37.31 82.8,38.58 83.44,39.22 84.71,39.22 85.34,39.85 85.34,43.66 87.25,45.57 104.39,45.57 105.66,44.3 124.08,44.3 v124.71,43.66 | v124.71,67.16 122.17,67.16 120.9,68.43 U$4.35 | v40.26,54.46 IC3.3
A15  (via drill 0.6)
  Top 0.254: IC4.46 53.59,35.41 v39.62,49.38 | v107.57,38.58 108.2,38.58 108.84,39.22 108.84,47.47 109.47,48.11 109.47,50.01 106.93,52.55 106.93,64.62 v107.57,65.25
  Bottom 0.254: IC4.46 61.85,35.41 63.12,34.14 80.9,34.14 83.44,31.6 84.71,31.6 85.34,32.23 85.34,33.5 85.98,34.14 87.25,34.14 89.15,36.04 89.15,37.31 89.79,37.95 106.93,37.95 v107.57,38.58 108.84,38.58 109.47,37.95 119.63,37.95 120.9,36.68 U$1.3 120.9,30.33 122.17,29.06 122.17,22.07 120.9,20.8 U$2.3 | U$4.36 118.36,69.06 119.63,67.79 119.63,65.89 119,65.25 v107.57,65.25 | v39.62,49.38 IC3.7
A16  (via drill 0.6)
  Top 0.254: IC4.47 62.48,36.68 54.23,36.68 v37.72,53.19 37.72,58.27 v39.62,60.17 | U$2.31 118.36,29.06 117.73,29.69 113.92,29.69 112.65,30.96 112.65,33.5 113.92,34.77 115.82,34.77 117.09,36.04 v117.09,42.39 118.36,43.66 U$1.31 118.36,50.65 117.09,51.92 117.09,60.17 115.82,61.44 v115.82,66.52 | v49.15,82.4 55.5,82.4 58.04,84.94 60.58,84.94 IC1.13 | v113.28,67.79 114.55,69.06 114.55,74.78 116.46,76.68 JP4.1
  Bottom 0.254: IC4.47 64.39,34.77 82.17,34.77 82.8,34.14 84.71,34.14 85.34,34.77 85.34,36.04 85.98,36.68 87.25,36.68 87.88,37.31 87.88,42.39 88.52,43.03 116.46,43.03 v117.09,42.39 | v39.62,60.17 39.62,73.51 48.51,82.4 v49.15,82.4 | v115.82,66.52 113.92,66.52 113.28,67.16 v113.28,67.79 | v37.72,53.19 IC3.4
A16*
  Top 0.254: JP4.2 117.73,81.13 118.36,80.49 118.36,76.68 115.82,74.14 U$4.37
A17  (via drill 0.6)
  Top 0.254: IC4.48 51.05,32.87 42.16,41.76 40.26,41.76 35.81,46.2 v35.81,50.65 34.54,51.92 v34.54,60.17 | v110.74,36.04 110.74,39.22 111.38,39.85 111.38,50.65 114.55,53.82 114.55,58.9 112.01,61.44 112.01,76.68 112.65,77.32 JP6.1 | v38.99,78.59 47.24,86.84 59.94,86.84 60.58,87.48 62.48,87.48 63.12,86.84 63.12,84.94 IC1.10
  Bottom 0.254: IC4.48 62.48,31.6 64.39,31.6 65.66,32.87 79.63,32.87 81.53,30.96 81.53,27.15 82.17,26.52 87.25,26.52 90.42,29.69 96.77,29.69 98.04,30.96 98.04,34.77 99.31,36.04 v110.74,36.04 117.73,36.04 118.36,35.41 U$1.2 118.36,30.33 119.63,29.06 119.63,22.07 118.36,20.8 U$2.2 | v34.54,60.17 34.54,74.14 v38.99,78.59 | v35.81,50.65 IC3.6
A17*
  Top 0.254: JP6.2 113.92,81.13 114.55,80.49 114.55,76.05 113.28,74.78 U$4.38
A18  (via drill 0.6)
  Top 0.254: IC4.49 62.48,34.14 51.05,34.14 42.16,43.03 40.89,43.03 v37.08,46.84 37.08,51.28 36.45,51.92 36.45,59.54 v37.08,60.17 | U$2.30 120.9,29.69 119.63,30.96 119.63,38.58 120.9,39.85 U$1.30 120.9,50.65 119.63,51.92 119.63,65.89 v118.36,67.16 | v47.88,83.67 54.86,83.67 57.4,86.21 IC1.11 | JP7.1 108.84,77.32 109.47,76.68 v109.47,69.7
  Bottom 0.254: IC4.49 64.39,32.87 65.02,33.5 80.26,33.5 82.17,31.6 82.17,29.69 82.8,29.06 84.71,29.06 85.34,29.69 85.34,30.96 85.98,31.6 87.25,31.6 87.88,32.23 87.88,33.5 89.79,35.41 89.79,36.68 90.42,37.31 118.36,37.31 119.63,36.04 119.63,30.33 120.9,29.06 U$2.30 | v37.08,60.17 37.08,74.14 46.61,83.67 v47.88,83.67 | v109.47,69.7 110.11,69.06 116.46,69.06 v118.36,67.16 | v37.08,46.84 IC3.9
A18*
  Top 0.254: JP7.2 110.11,81.13 110.74,80.49 U$4.39
A19  (via drill 0.6)
  Top 0.254: 42.16,39.22 v37.08,39.22 | 42.16,39.22 51.05,30.33 IC4.50 62.48,31.6 v65.66,31.6 | 42.16,39.22 36.45,39.22 35.81,39.85 35.81,42.39 34.54,43.66 34.54,48.74 32,51.28 v32,60.17 | v36.45,78.59 36.45,80.49 37.72,81.76 40.89,81.76 46.61,87.48 59.31,87.48 59.94,88.11 63.75,88.11 64.39,87.48 IC1.9
  Bottom 0.254: v37.08,39.22 35.81,37.95 IC2.3 | v65.66,31.6 66.29,32.23 78.99,32.23 80.9,30.33 80.9,25.88 82.8,23.98 87.25,23.98 87.88,24.61 87.88,25.25 91.69,29.06 97.41,29.06 98.68,30.33 98.68,33.5 99.95,34.77 115.19,34.77 115.82,34.14 U$1.1 115.82,30.96 117.09,29.69 117.09,22.71 115.82,21.44 U$2.1 | v32,60.17 32,74.14 v36.45,78.59
A20  (via drill 0.6)
  Top 0.254: v42.16,37.95 51.05,29.06 62.48,29.06 IC4.51
  Bottom 0.254: IC1.36 63.12,57 63.12,55.09 62.48,54.46 58.67,54.46 51.05,46.84 51.05,39.85 49.15,37.95 v42.16,37.95 40.89,36.68 IC2.4
A21  (via drill 0.6)
  Top 0.254: IC4.53 62.48,26.52 52.32,26.52 v42.16,36.68
  Bottom 0.254: IC4.53 65.02,26.52 65.02,24.61 64.39,23.98 58.67,23.98 56.13,21.44 41.53,21.44 37.72,17.63 37.72,16.36 35.18,13.82 IC7.9 | v42.16,36.68 49.15,36.68 51.69,39.22 51.69,46.2 59.31,53.82 63.12,53.82 64.39,55.09 IC1.35
A22  (via drill 0.6)
  Top 0.254: IC4.54 52.32,25.25 v39.62,37.95
  Bottom 0.254: IC4.54 58.67,25.25 55.5,22.07 40.89,22.07 37.08,18.26 37.08,16.99 35.18,15.09 IC7.8 | v39.62,37.95 40.89,39.22 48.51,39.22 50.42,41.12 50.42,47.47 58.67,55.73 IC1.33
A23  (via drill 0.6)
  Top 0.254: v38.35,37.95 52.32,23.98 62.48,23.98 IC4.55
  Bottom 0.254: IC4.55 62.48,26.52 58.67,26.52 54.86,22.71 40.26,22.71 36.45,18.9 36.45,17.63 35.18,16.36 IC7.7 | IC1.34 59.94,56.36 58.04,56.36 49.78,48.11 49.78,41.76 47.88,39.85 40.26,39.85 v38.35,37.95
ADR_CLK
  Bottom 0.254: 28.83,29.06 28.83,13.82 27.56,12.55 IC7.11 20.57,12.55 19.3,11.28 19.3,10.64 18.67,10.01 R19.1 | 23.11,29.06 IC2.11 28.83,29.06 | 28.83,29.06 28.83,44.3 27.56,45.57 IC3.11 23.11,45.57
AS
  Bottom 0.254: U$3.14 123.44,81.13 108.84,95.73 77.72,95.73 77.09,95.1 IC1.83
B_A0
  Bottom 0.254: J1.C5 11.68,20.8 14.86,17.63 IC7.15
B_A1
  Bottom 0.254: J1.C7 16.76,25.88 19.94,22.71 IC7.19
B_A2
  Bottom 0.254: J1.A6 6.6,22.07 11.68,22.07 13.59,20.17 IC7.17
B_A3
  Bottom 0.254: J1.C6 11.68,23.34 13.59,21.44 IC7.18
B_A4
  Bottom 0.254: J1.A7 6.6,27.15 11.05,27.15 14.22,30.33 IC2.12
B_A5
  Bottom 0.254: J1.A8 6.6,29.69 11.05,29.69 14.22,32.87 IC2.14
B_A6
  Bottom 0.254: J1.A9 6.6,32.23 11.05,32.23 14.22,35.41 IC2.16
B_A7
  Bottom 0.254: J1.C9 11.05,30.96 14.22,34.14 IC2.15
B_A8
  Bottom 0.254: J1.C8 11.05,28.42 14.22,31.6 IC2.13
B_A9
  Bottom 0.254: J1.A30 6.6,85.57 20.57,85.57 21.21,84.94 21.21,56.36 21.84,55.73 IC3.19
B_A10
  Bottom 0.254: J1.C18 11.68,53.82 13.59,51.92 13.59,49.38 14.86,48.11 IC3.13
B_A11
  Bottom 0.254: J1.C17 12.32,49.38 12.32,46.84 13.59,45.57 20.57,45.57 21.21,44.93 21.21,39.85 21.84,39.22 IC2.19
B_A12
  Bottom 0.254: J1.C27 18.67,76.68 19.3,76.05 19.3,52.55 19.94,51.92 IC3.16
B_A13
  Bottom 0.254: J1.A29 6.6,83.03 19.94,83.03 20.57,82.4 20.57,55.09 21.21,54.46 IC3.18
B_A14
  Bottom 0.254: J1.A18 6.6,55.09 12.32,55.09 14.22,53.19 14.22,50.01 14.86,49.38 IC3.14
B_A15
  Bottom 0.254: J1.C28 19.3,79.22 19.94,78.59 19.94,53.82 20.57,53.19 IC3.17
B_A16
  Bottom 0.254: J1.C19 12.95,56.36 14.86,54.46 14.86,51.28 15.49,50.65 IC3.15
B_A17
  Bottom 0.254: J1.A17 6.6,52.55 11.05,52.55 12.95,50.65 12.95,48.11 14.22,46.84 IC3.12
B_A18
  Bottom 0.254: J1.A12 6.6,39.85 11.05,39.85 12.95,37.95 IC2.18
B_A19
  Bottom 0.254: J1.C12 12.32,36.68 IC2.17
B_A20
  Bottom 0.254: J1.B2 9.14,14.45 11.68,14.45 12.32,13.82 IC7.12
B_A21
  Bottom 0.254: J1.B3 9.14,16.99 11.05,16.99 12.95,15.09 IC7.13
B_A22
  Bottom 0.254: J1.B4 9.14,19.53 11.05,19.53 14.22,16.36 IC7.14
B_BANK  (via drill 0.6)
  Top 0.254: v19.94,44.3 20.57,44.93 20.57,61.44 23.11,63.98 47.24,63.98 51.05,67.79 56.77,67.79 57.4,67.16 60.58,67.16 IC1.25
  Bottom 0.254: v19.94,44.3 16.76,41.12 J1.C13
B_D0
  Top 0.254: J1.C2 17.4,13.18 19.3,15.09 IC8.17
B_D1
  Top 0.254: J1.C14 16.13,43.66 20.57,39.22 IC5.11
B_D2
  Top 0.254: J1.C4 14.86,18.26 16.76,20.17 IC8.13
B_D3
  Top 0.254: J1.A4 6.6,16.99 15.49,16.99 17.4,18.9 IC8.14
B_D4
  Top 0.254: J1.A5 6.6,19.53 14.22,19.53 16.13,21.44 IC8.12
B_D5
  Top 0.254: J1.A2 6.6,11.91 18.03,11.91 19.94,13.82 IC8.18
B_D6
  Top 0.254: J1.A3 6.6,14.45 16.76,14.45 18.67,16.36 IC8.16
B_D7
  Top 0.254: J1.C3 16.13,15.72 18.03,17.63 IC8.15
B_D8
  Top 0.254: J1.B6 9.14,22.07 14.86,22.07 15.49,22.71 IC8.11
B_D9
  Top 0.254: J1.B7 9.14,24.61 13.59,24.61 19.3,30.33 IC5.18
B_D10
  Top 0.254: J1.B8 9.14,27.15 13.59,27.15 18.03,31.6 IC5.17
B_D11
  Top 0.254: J1.B9 9.14,29.69 13.59,29.69 16.76,32.87 IC5.16
B_D12
  Top 0.254: J1.B10 9.14,32.23 13.59,32.23 15.49,34.14 IC5.15
B_D13
  Top 0.254: J1.B11 9.14,34.77 13.59,34.77 14.22,35.41 IC5.14
B_D14
  Top 0.254: J1.B12 9.14,37.31 13.59,37.31 14.22,36.68 IC5.13
B_D15
  Top 0.254: J1.B13 9.14,42.39 12.95,42.39 17.4,37.95 IC5.12
B_IOR
  Top 0.254: J1.A27 6.6,77.95 14.86,77.95 19.3,73.51 40.26,73.51 45.34,78.59 56.13,78.59 58.67,81.13 IC1.14
B_MEMR
  Top 0.254: J1.C30 14.86,84.3 16.76,82.4 16.76,79.22 21.21,74.78 39.62,74.78 44.7,79.86 56.13,79.86 58.67,82.4 60.58,82.4 IC1.15
B_RD  (via drill 0.6)
  Top 0.254: U$2.24 136.14,29.69 134.87,30.96 134.87,43.03 136.14,44.3 U$1.24 | U$4.20 156.46,40.49 157.1,39.85 157.1,20.17 155.19,18.26 152.02,18.26 148.21,14.45 135.51,14.45 v134.87,15.09 | J1.C24 42.8,69.06 49.78,76.05 IC1.18 | v129.16,95.73 95.5,95.73 94.23,94.46 94.23,91.29 93.6,90.65 84.71,90.65 80.9,86.84 80.9,83.03 80.26,82.4 73.91,82.4 73.28,83.03 73.28,84.3 72.64,84.94 v65.66,84.94
  Bottom 0.254: v134.87,15.09 134.87,20.8 136.14,22.07 U$2.24 | IC1.18 58.04,76.05 57.4,76.68 57.4,81.76 58.04,82.4 59.94,82.4 60.58,83.03 60.58,84.3 61.21,84.94 v65.66,84.94 | v129.16,95.73 143.76,95.73 145.03,94.46 145.03,86.84 151.38,80.49 151.38,76.05 152.65,74.78 152.65,64.62 156.46,60.81 U$4.20
B_WR  (via drill 0.6)
  Top 0.254: J1.C22 12.95,63.98 16.76,67.79 43.43,67.79 50.42,74.78 60.58,74.78 IC1.21 | U$2.29 123.44,29.69 122.17,30.96 122.17,43.66 123.44,44.93 U$1.29 | v105.03,76.68 105.66,76.05 105.66,58.27 106.3,57.63 106.3,50.65 v108.2,48.74
  Bottom 0.254: U$1.29 123.44,49.38 122.17,50.65 110.11,50.65 v108.2,48.74 | U$3.15 125.98,76.68 125.35,76.05 105.66,76.05 v105.03,76.68 104.39,77.32 104.39,90.65 99.95,95.1 81.53,95.1 80.9,94.46 80.9,83.03 80.26,82.4 61.21,82.4 60.58,81.76 60.58,74.78 IC1.21
CLK  (via drill 0.6)
  Top 0.254: QG1.8 101.22,39.22 98.68,41.76 98.68,77.32 v97.41,78.59 | IC1.75 88.52,87.48 v94.87,87.48
  Bottom 0.254: R9.2 98.04,22.07 99.95,23.98 100.58,23.98 101.85,25.25 101.85,30.33 QG1.8 | v94.87,87.48 95.5,87.48 97.41,85.57 v97.41,78.59
D0  (via drill 0.6)
  Top 0.254: IC4.5 78.99,13.82 80.9,11.91 108.84,11.91 111.38,14.45 111.38,23.34 112.65,24.61 146.3,24.61 147.57,25.88 147.57,31.6 U$1.13 146.3,36.68 147.57,37.95 147.57,59.54 148.21,60.17 153.29,60.17 153.92,59.54 U$4.19 | v46.61,8.1 46.61,18.26 43.43,21.44 IC8.9
  Bottom 0.254: IC4.5 78.99,6.83 78.36,6.2 48.51,6.2 v46.61,8.1
D1  (via drill 0.6)
  Top 0.254: v47.88,10.01 47.88,18.26 37.08,29.06 IC5.2 | IC4.4 77.72,16.36 77.72,13.82 80.26,11.28 110.11,11.28 112.65,13.82 112.65,20.17 114.55,22.07 148.21,22.07 150.11,23.98 150.11,29.06 148.84,30.33 U$1.14 148.84,36.68 150.11,37.95 150.11,51.92 151.38,53.19 U$4.18
  Bottom 0.254: IC4.4 75.18,16.36 75.18,9.37 73.28,7.47 51.69,7.47 49.15,10.01 v47.88,10.01
D2  (via drill 0.6)
  Top 0.254: v49.15,8.1 49.15,18.26 37.08,30.33 IC5.3 | IC4.3 76.45,13.82 79.63,10.64 111.38,10.64 113.92,13.18 113.92,18.9 116.46,21.44 150.11,21.44 152.65,23.98 152.65,29.69 151.38,30.96 U$1.15 151.38,36.68 152.65,37.95 152.65,58.27 152.02,58.9 149.48,58.9 148.84,58.27 U$4.17
  Bottom 0.254: IC4.3 76.45,8.74 74.55,6.83 50.42,6.83 v49.15,8.1
D3  (via drill 0.6)
  Top 0.254: v50.42,11.28 50.42,18.26 37.08,31.6 IC5.4 | IC4.2 75.18,16.36 75.18,13.18 78.36,10.01 121.54,10.01 122.17,10.64 122.17,18.9 124.08,20.8 153.29,20.8 155.19,22.71 155.19,34.77 153.92,36.04 U$1.17
  Bottom 0.254: IC4.2 72.64,16.36 72.64,10.64 70.74,8.74 54.23,8.74 51.69,11.28 v50.42,11.28 | U$4.16 146.3,58.27 146.94,58.9 149.48,58.9 150.11,58.27 150.11,55.09 150.75,54.46 152.02,54.46 153.92,52.55 U$1.17
D4  (via drill 0.6)
  Top 0.254: v51.69,9.37 51.69,18.26 37.08,32.87 IC5.5 | IC4.1 73.91,13.18 77.72,9.37 123.44,9.37 124.71,10.64 124.71,18.26 125.98,19.53 153.92,19.53 155.83,21.44 155.83,36.04 v155.19,36.68
  Bottom 0.254: IC4.1 73.91,10.01 72.01,8.1 52.96,8.1 v51.69,9.37 | U$4.15 143.76,55.73 145.03,54.46 148.84,54.46 151.38,51.92 U$1.18 151.38,45.57 152.02,44.93 155.83,44.93 156.46,44.3 156.46,37.95 v155.19,36.68
D5  (via drill 0.6)
  Top 0.254: v52.96,11.91 52.96,18.26 37.08,34.14 IC5.6 | IC4.68 72.64,16.36 72.64,13.18 77.09,8.74 125.98,8.74 127.25,10.01 127.25,16.99 129.16,18.9 154.56,18.9 156.46,20.8 156.46,37.31 v155.19,38.58
  Bottom 0.254: IC4.68 70.1,16.36 70.1,11.28 68.83,10.01 56.13,10.01 54.23,11.91 v52.96,11.91 | U$4.14 143.76,53.82 148.21,53.82 148.84,53.19 U$1.19 148.84,43.03 153.29,38.58 v155.19,38.58
D6  (via drill 0.6)
  Top 0.254: v54.23,10.64 54.23,18.26 37.08,35.41 IC5.7 | IC4.67 71.37,13.18 76.45,8.1 128.52,8.1 129.79,9.37 129.79,16.36 131.06,17.63 v149.48,17.63
  Bottom 0.254: IC4.67 71.37,10.64 70.1,9.37 57.4,9.37 | 57.4,9.37 56.77,9.37 | 57.4,9.37 55.5,9.37 v54.23,10.64 | U$4.13 140.59,54.46 141.86,54.46 143.13,53.19 145.03,53.19 146.3,51.92 U$1.20 146.3,43.03 150.11,39.22 150.11,18.26 v149.48,17.63
D7  (via drill 0.6)
  Top 0.254: v55.5,13.18 55.5,18.26 37.08,36.68 IC5.8 | IC4.66 70.1,16.36 70.1,13.18 75.82,7.47 131.06,7.47 132.33,8.74 132.33,15.09 133.6,16.36 v147.57,16.36 | U$4.12 136.14,63.98 138.05,65.89 146.3,65.89 147.57,67.16 147.57,73.51 146.94,74.14 v138.05,74.14
  Bottom 0.254: IC4.66 67.56,16.36 67.56,12.55 66.29,11.28 57.4,11.28 v55.5,13.18 | U$4.12 136.14,55.09 137.41,53.82 141.22,53.82 143.76,51.28 U$1.21 143.76,43.03 147.57,39.22 v147.57,16.36 | v138.05,74.14 137.41,74.78 137.41,80.49 136.14,81.76 125.98,81.76 110.74,97 74.55,97 73.28,95.73 73.28,84.94 IC1.2
D8  (via drill 0.6)
  Top 0.254: IC4.65 68.83,13.18 75.18,6.83 138.05,6.83 139.32,8.1 144.4,8.1 146.3,10.01 U$2.13 146.3,13.18 146.94,13.82 148.84,13.82 152.02,16.99 155.19,16.99 157.73,19.53 157.73,74.78 157.1,75.41 142.49,75.41 | U$4.10 131.06,67.16 132.33,68.43 132.33,74.14 133.6,75.41 142.49,75.41 | 142.49,75.41 142.49,86.84 141.22,88.11 U$3.4 | v42.16,13.82 IC8.3
  Bottom 0.254: v42.16,13.82 53.59,13.82 56.77,10.64 67.56,10.64 68.83,11.91 IC4.65
D9  (via drill 0.6)
  Top 0.254: v56.77,14.45 56.77,18.26 37.08,37.95 IC5.9 | IC4.64 67.56,16.36 67.56,13.18 74.55,6.2 139.32,6.2 140.59,7.47 146.94,7.47 148.84,9.37 U$2.14 148.84,12.55 152.65,16.36 155.83,16.36 158.37,18.9 158.37,76.05 157.1,77.32 154.56,77.32 150.75,81.13 150.75,93.83 149.48,95.1 139.32,95.1 138.68,94.46 U$3.5 138.68,82.4 137.41,81.13 136.14,81.13 134.87,79.86 134.87,76.68 134.24,76.05 131.06,76.05 129.79,74.78 129.79,69.7 128.52,68.43 U$4.9
  Bottom 0.254: IC4.64 65.02,16.36 65.02,13.82 63.75,12.55 58.67,12.55 v56.77,14.45
D10  (via drill 0.6)
  Top 0.254: IC4.63 66.29,12.55 73.28,5.56 140.59,5.56 141.86,6.83 148.84,6.83 151.38,9.37 U$2.15 151.38,13.82 153.29,15.72 156.46,15.72 159,18.26 159,76.68 157.73,77.95 155.19,77.95 152.02,81.13 152.02,93.83 150.11,95.73 136.78,95.73 136.14,95.1 U$3.6 136.14,83.03 134.87,81.76 131.7,81.76 129.79,79.86 129.79,76.68 129.16,76.05 127.89,76.05 127.25,75.41 127.25,69.7 125.98,68.43 U$4.8 | v44.07,15.72 44.07,18.26 43.43,18.9 IC8.7
  Bottom 0.254: v44.07,15.72 44.7,15.09 54.86,15.09 58.04,11.91 65.02,11.91 66.29,13.18 IC4.63
D11  (via drill 0.6)
  Top 0.254: IC4.62 65.02,16.36 65.02,12.55 72.64,4.93 141.86,4.93 143.13,6.2 150.11,6.2 152.65,8.74 152.65,13.18 v153.92,14.45 | U$4.7 123.44,67.79 124.71,69.06 124.71,75.41 125.35,76.05 126.62,76.05 127.25,76.68 127.25,79.86 131.06,83.67 132.97,83.67 133.6,84.3 U$3.7 | v42.8,17.63 IC8.6
  Bottom 0.254: IC4.62 62.48,16.36 59.94,16.36 58.04,18.26 43.43,18.26 v42.8,17.63 | v153.92,14.45 U$2.17 153.92,28.42 154.56,29.06 157.1,29.06 158.37,30.33 158.37,51.92 155.19,55.09 155.19,59.54 153.29,61.44 152.02,61.44 150.11,63.35 150.11,79.86 145.03,84.94 135.51,84.94 133.6,86.84 U$3.7
D12  (via drill 0.6)
  Top 0.254: v45.34,16.99 45.34,18.26 43.43,20.17 IC8.8 | IC4.61 63.75,12.55 72.01,4.29 143.13,4.29 143.76,4.93 150.75,4.93 v151.38,5.56 | U$4.6 120.9,67.16 122.17,68.43 122.17,75.41 122.81,76.05 124.08,76.05 124.71,76.68 124.71,79.86 125.35,80.49 125.98,80.49 131.06,85.57 U$3.8
  Bottom 0.254: IC4.61 57.4,15.09 56.77,15.72 46.61,15.72 v45.34,16.99 | v151.38,5.56 152.65,6.83 152.65,21.44 151.38,22.71 U$2.18 151.38,29.69 152.02,30.33 155.83,30.33 157.1,31.6 157.1,51.28 152.65,55.73 152.65,58.9 150.75,60.81 149.48,60.81 147.57,62.71 147.57,78.59 143.13,83.03 134.24,83.03 131.06,86.21 U$3.8
D13  (via drill 0.6)
  Top 0.254: IC4.60 61.21,11.28 v68.83,3.02 | U$3.9 128.52,85.57 122.17,79.22 122.17,76.68 119.63,74.14 119.63,70.33 117.09,67.79 117.09,62.08 118.36,60.81 U$4.5 118.36,51.92 119.63,50.65 119.63,41.76 118.36,40.49 118.36,35.41 117.09,34.14 117.09,31.6 116.46,30.96 114.55,30.96 v113.92,31.6 | U$2.19 148.84,25.25 146.94,23.34 v145.03,23.34 v113.92,23.34 | v38.99,12.55 IC8.2
  Bottom 0.254: IC4.60 59.94,17.63 58.67,18.9 42.8,18.9 40.89,16.99 40.89,13.82 39.62,12.55 v38.99,12.55 | v68.83,3.02 143.13,3.02 145.03,4.93 v145.03,23.34 | v113.92,23.34 v113.92,31.6
D14  (via drill 0.6)
  Top 0.254: IC4.59 62.48,18.9 62.48,11.91 70.74,3.66 v145.67,3.66 | U$3.10 125.98,86.21 119.63,79.86 119.63,76.05 117.09,73.51 117.09,69.7 114.55,67.16 114.55,60.81 115.82,59.54 U$4.4 115.82,51.28 117.09,50.01 117.09,44.93 115.82,43.66 v115.82,41.76 | v38.99,15.09 IC8.4
  Bottom 0.254: IC4.59 62.48,18.9 59.94,18.9 59.31,19.53 42.16,19.53 40.26,17.63 40.26,15.72 39.62,15.09 v38.99,15.09 | v145.67,3.66 146.3,3.66 147.57,4.93 147.57,13.82 146.3,15.09 U$2.20 146.3,30.33 145.03,31.6 145.03,37.95 141.86,41.12 116.46,41.12 v115.82,41.76
D15  (via drill 0.6)
  Top 0.254: U$3.11 123.44,90.65 122.81,90.02 108.2,90.02 106.93,88.75 106.93,69.7 110.11,66.52 110.11,60.81 110.74,60.17 112.01,60.17 113.28,58.9 U$4.3 113.28,55.73 110.11,52.55 v110.11,41.76 | IC4.58 59.94,20.17 59.31,19.53 59.31,10.01 v65.02,3.66 | v38.99,16.36 IC8.5
  Bottom 0.254: IC4.58 41.53,20.17 38.99,17.63 v38.99,16.36 | v110.11,41.76 111.38,40.49 138.68,40.49 142.49,36.68 142.49,30.96 143.76,29.69 U$2.21 143.76,24.61 142.49,23.34 142.49,6.2 140.59,4.29 65.66,4.29 v65.02,3.66
DIR  (via drill 0.6)
  Top 0.254: 21.21,43.03 21.21,41.76 22.48,40.49 26.92,40.49 30.73,36.68 30.73,29.06 32,27.79 IC5.1 | v4.06,29.69 3.43,30.33 3.43,44.3 4.06,44.93 16.76,44.93 18.67,43.03 21.21,43.03 | 21.21,43.03 21.21,60.81 23.11,62.71 48.51,62.71 51.05,65.25 58.67,65.25 IC1.26 | IC5.1 33.27,27.79 | IC5.1 33.22,25.2 31.37,23.34 31.37,11.91 32,11.28 IC8.1 33.27,11.28
  Bottom 0.254: v16.13,23.98 14.22,23.98 13.59,24.61 4.06,24.61 3.43,25.25 3.43,29.06 v4.06,29.69
DS
  Bottom 0.254: U$3.17 131.06,79.86 130.43,80.49 125.98,80.49 110.11,96.37 76.45,96.37 75.82,95.73 75.82,84.94 IC1.84
E
  Top 0.254: IC4.22 87.88,32.87 89.15,34.14 89.15,57.63 IC1.54
FC0
  Top 0.254: IC4.30 80.26,39.22 80.26,43.66 78.36,45.57 78.36,57 IC1.48
FC1
  Top 0.254: IC4.29 81.53,44.3 79.63,46.2 IC1.47
FC2
  Top 0.254: IC4.28 82.8,39.22 82.8,45.57 80.9,47.47 80.9,57 IC1.50
GND  (via drill 0.6)
  Top 0.254: C16.2 16.89,89.25 v16.76,89.38 | C19.2 27.56,26.52 | 32.64,22.71 IC8.10 35.81,22.71 36.45,23.34 v36.45,27.79 | IC5.10 32.64,39.22 30.73,41.12 v30.1,41.12
  Top 0.406: C12.2 113.28,36.04 112.01,34.77 110.11,34.77 108.84,33.5 QG1.7 | 27.56,43.03 C20.2 | C25.- 27.56,45.61 27.56,43.03 | v30.1,41.12 28.19,41.12 27.56,41.76 27.56,43.03 | C19.2 27.43,24.74 28.19,23.98 v30.1,23.98
  Bottom 0.254: 78.86,23.85 v78.99,23.98 | 34.54,87.48 C9.2 | IC10.4 34.54,87.48 | C18.2 67.56,72.24 67.56,69.06 | IC1.27 66.93,65.89 | 66.93,65.89 67.56,65.89 67.56,69.06 | 66.93,65.89 C7.2 | 67.56,69.06 67.56,69.7 C17.2 81.53,69.7 81.53,77.32 | C8.2 81.53,80.49 81.53,77.32 | 81.53,77.32 C1.2 | v68.83,26.52 68.96,26.65 | 98.68,63.35 98.81,63.22 | 31.37,5.56 C23.- | IC2.10 35.81,29.06 36.45,28.42 v36.45,27.79 | 30.23,41.25 v30.1,41.12 | C6.2 30.1,26.52 | R1.2 34.54,90.02 34.54,87.48
  Bottom 0.406: C2.2 78.86,23.85 | 68.96,26.65 C5.2 | 110.11,18.13 108.07,18.13 v106.3,16.36 | 110.11,18.13 C10.2 | 98.81,63.22 C14.2 | v99.95,60.81 98.68,61.44 C15.2 98.68,63.35 96.73,63.35 C28.- | C27.- 69.43,26.52 v68.83,26.52 | C4.2 30.1,8.74 | v148.21,86.21 150.11,86.21 | 150.11,86.21 C13.2 | C26.- 152.06,86.21 150.11,86.21 | 110.11,18.13 C29.- | IC7.10 33.22,10.06 33.27,10.01 v32,8.74 C4.2 | C4.2 30.23,6.7 31.37,5.56 | IC3.10 34.54,45.57 v35.81,44.3 | C3.2 30.23,41.25 | 30.1,26.52 v30.1,23.98 | C11.- 28.87,78.59 JP3.1
  other vias: 85.98,88.11 90.42,86.21 96.14,88.11 96.14,79.22 100.58,41.12 99.31,39.22 100.58,29.06 104.39,30.33 108.84,27.15 64.39,79.22 77.09,81.13 71.37,72.87 84.71,60.81 85.34,73.51 64.39,60.81 66.29,20.17 78.36,30.33 80.9,72.87 77.72,65.25 65.66,67.79
  pour Top (isolate 0.254): 63.12,79.86 65.66,82.4 65.66,83.67 68.2,83.67 68.2,82.4 68.83,81.76 84.07,81.76 85.98,79.86 85.98,68.43 86.61,67.79 89.15,67.79 89.79,67.16 89.79,65.89 89.15,65.25 87.88,65.25 85.98,63.35 85.98,61.44 84.07,59.54 73.91,59.54 72.64,58.27 71.37,58.27 70.1,59.54 65.02,59.54 63.12,61.44 63.12,63.98 61.85,65.25 61.85,66.52 63.12,67.79
  pour Top (isolate 0.254): 85.98,88.75 96.14,88.75 96.77,88.11 96.77,86.84 96.14,86.21 89.15,86.21 88.52,85.57 87.25,84.3 85.98,84.3 85.34,84.94 85.34,88.11
  pour Bottom (isolate 0.254): 93.6,88.11 94.23,88.75 98.04,88.75 98.68,88.11 98.68,77.95 98.04,77.32 96.77,77.32 96.14,77.95 96.14,84.94 94.87,86.21 94.23,86.21 93.6,86.84
  pour Top (isolate 0.254): 96.14,79.22 96.77,79.86 98.04,79.86 99.95,77.95 99.95,43.03 102.49,40.49 102.49,31.6 103.12,30.96 107.57,30.96 109.47,29.06 109.47,18.26 106.93,15.72 103.12,15.72 100.58,18.26 100.58,28.42 99.31,29.69 99.31,39.22 98.04,40.49 98.04,75.41 96.14,77.32
  pour Top (isolate 0.254): 65.02,34.77 66.93,36.68 80.26,36.68 82.17,34.77 82.17,27.15 82.8,26.52 85.98,26.52 86.61,25.88 86.61,24.61 85.98,23.98 82.8,23.98 82.17,23.34 82.17,20.17 80.9,18.9 66.29,18.9 65.02,20.17 65.02,20.8 64.39,21.44 61.85,21.44 61.21,22.07 61.21,23.34 61.85,23.98 64.39,23.98 65.02,24.61
  pour Bottom (isolate 0.254): 101.85,32.87 100.58,32.87 99.95,32.87 99.31,32.23 99.31,27.79 98.68,27.15 98.68,25.25 97.41,23.98 90.42,23.98 89.79,23.34 89.79,20.8 90.42,20.17 98.04,20.17 98.68,19.53 98.68,15.72 99.95,14.45 103.76,14.45 104.39,15.09 104.39,32.23 103.76,32.87
  pour Bottom (isolate 0.254): 61.85,65.25 61.85,66.52 62.48,67.16 63.75,67.16 63.75,69.06 65.02,70.33 66.29,70.33 66.93,70.97 66.93,80.49 68.2,81.76 80.26,81.76 80.9,81.13 81.53,80.49 81.53,65.25 80.26,63.98 63.12,63.98
IRQ0
  Top 0.254: IC1.82 78.36,84.94 78.36,95.1 77.09,96.37 19.3,96.37 11.05,88.11 4.7,88.11 3.43,86.84 3.43,63.98 4.7,62.71 6.6,62.71 J1.B21
IRQ1
  Top 0.254: IC1.81 79.63,95.73 78.36,97 18.67,97 12.32,90.65 4.7,90.65 2.79,88.75 2.79,61.44 4.06,60.17 6.6,60.17 J1.B20
IRQ2  (via drill 0.6)
  Top 0.254: J1.B19 6.6,57.63 2.16,57.63 1.52,58.27 1.52,88.75 4.7,91.92 v11.05,91.92 | IC1.7 66.93,88.11 66.29,88.75 42.16,88.75 v39.62,91.29
  Bottom 0.254: v11.05,91.92 13.59,91.92 16.13,94.46 36.45,94.46 v39.62,91.29
IRQ3  (via drill 0.6)
  Top 0.254: J1.B18 6.6,55.09 2.16,55.09 0.89,56.36 0.89,88.75 4.7,92.56 9.78,92.56 v11.05,93.83 | IC1.5 69.47,88.75 68.83,89.38 44.7,89.38 v42.8,91.29
  Bottom 0.254: v11.05,93.83 14.22,93.83 15.49,95.1 38.99,95.1 v42.8,91.29
MEMSEL
  Top 0.254: R12.1 56.77,94.46 57.4,93.83 57.4,93.19 58.04,92.56 60.58,92.56 JP5.3
  Bottom 0.254: JP5.3 66.29,91.29 68.2,89.38 68.2,84.94 IC1.6
N$1
  Bottom 0.254: R1.1 32,90.02 IC10.6
N$2
  Top 0.254: JP4.3 JP6.3 111.38,83.67 | JP7.3 111.38,83.67 | R13.1 111.25,83.8 111.38,83.67
N$4
  Bottom 0.406: C11.+ 32,82.99 IC10.3
N$6
  Bottom 0.254: C9.1 27.56,87.48 26.92,86.84 IC10.1
N$7
  Top 0.254: JP3.2 28.83,81.13 29.46,81.76 IC10.2 29.46,88.11 28.32,89.25 R8.2
N$424
  Bottom 0.254: IC4.15 85.34,21.44 85.34,19.53 85.98,18.9 87.88,18.9 89.15,20.17 89.15,21.44 89.79,22.07 R9.1 91.69,22.07
R/#W
  Top 0.254: IC4.9 85.98,15.09 94.23,23.34 94.23,51.28 95.5,52.55 95.5,71.6 92.33,74.78 88.52,74.78 IC1.69
ROM1
  Top 0.254: R15.1 70.1,94.46 70.74,93.83 70.74,93.19 71.37,92.56 73.28,92.56 JP8.3
  Bottom 0.254: IC1.1 JP8.3
ROM2
  Top 0.254: JP8.1 R16.1
  Bottom 0.254: IC1.3 JP8.1
TCK
  Top 0.254: SV1.3 54.86,63.98 58.04,60.81 IC1.30
TDI
  Bottom 0.254: IC1.28 58.04,63.35 55.5,65.89 55.5,68.43 54.86,69.06 SV1.5
TDO  (via drill 0.6)
  Top 0.254: v65.66,53.82 59.94,53.82 55.5,58.27 v55.5,61.44
  Bottom 0.254: IC1.59 88.52,62.08 88.52,55.09 87.25,53.82 v65.66,53.82 | v55.5,61.44 55.5,63.35 54.23,64.62 54.23,65.25 52.96,66.52 SV1.4
TMS
  Bottom 0.254: SV1.6 55.5,71.6 57.4,69.7 59.94,69.7 60.58,69.06 60.58,64.62 IC1.29
TRISTATE  (via drill 0.6)
  Top 0.254: v30.1,22.71 25.65,22.71 | 25.65,22.71 25.65,28.42 25.02,29.06 IC5.19 23.11,29.06 | 25.65,22.71 25.65,13.18 25.02,12.55 IC8.19 23.11,12.55
  Bottom 0.254: IC7.1 33.22,26.57 31.37,28.42 v31.37,39.22 31.37,39.85 32,40.49 IC2.1 | IC2.1 33.27,40.49 | IC2.1 33.22,43.08 31.37,44.93 31.37,56.36 32,57 33.27,57 | IC3.1 33.27,57 | v30.1,22.71 30.73,22.71 32,23.98 IC7.1 | IC7.1 33.27,23.98 | 33.27,57 48.51,57 49.15,57.63 54.86,57.63 56.77,59.54 60.58,59.54 IC1.31
VCC  (via drill 0.6)
  Top 0.254: C16.1 18.67,91.92 18.8,92.05 R8.1 26.42,92.05 IC10.8 | R13.2 115.19,87.48 v116.46,86.21 | R16.2 66.16,94.33 66.29,94.46 R15.2 v64.39,94.46 | R14.2 52.96,91.29 52.83,91.42 R12.2 v51.05,94.46 | IC8.20 v21.21,11.28 | IC5.20 23.17,27.1 23.75,26.52 v24.38,26.52
  Top 0.406: 33.86,40.49 33.86,41.81 32.64,43.03 v32,43.03 C20.1 30.1,43.03 30.1,45.61 C25.+ | C19.1 31.37,25.88 v32,25.25 | C12.1 113.28,46.84 114.55,48.11 U$1.32
  $GND 0.254: v96.14,18.9 96.77,18.9 | v97.41,25.25 97.41,25.88 | v97.41,39.85 97.41,40.49
  $VCC 0.254: v81.53,20.17 80.9,19.53
  Bottom 0.254: QG1.14 101.85,16.36 | v81.53,20.17 81.66,20.3 | R3.2 v96.14,18.9 | R2.2 v97.41,25.25 | R7.2 v97.41,39.85 | v97.41,35.41 96.77,34.77 R10.2 94.23,34.77 94.36,34.64 R11.2 | R6.2 13.59,63.98 13.72,64.11 R5.2 | R5.2 15.62,64.11 v15.49,63.98 | R5.2 17.4,63.98 | R4.2 R5.2 | C14.1 101.85,65.89 | 98.68,65.89 98.81,66.02 | 26.29,5.56 C23.+ | C6.1 27.56,26.52 | C3.1 27.56,43.03 | v27.56,10.64 27.43,10.51 | IC3.20 23.17,58.22 v23.11,58.27 | R18.1 v38.99,88.11 | R19.2 12.95,10.01 12.32,10.64 J1.C1
  Bottom 0.406: IC4.52 62.48,29.06 C5.1 66.93,28.29 66.93,23.98 C27.+ | 81.66,20.3 C2.1 | IC1.22 60.58,72.24 C18.1 65.02,72.24 65.02,74.82 C21.+ | IC1.64 88.52,69.7 C17.1 84.07,69.7 84.07,72.83 C24.+ | C1.1 85.34,77.32 85.98,77.95 85.98,79.86 IC1.73 | C8.1 84.2,81.89 84.71,82.4 IC1.78 | IC1.38 C7.1 66.93,61.44 70.14,61.44 C22.+ | U$2.32 115.82,22.71 113.92,20.8 | U$4.40 105.66,71.6 104.39,70.33 103.12,70.33 101.85,69.06 C14.1 98.81,66.02 | U$3.1 148.84,92.56 150.11,91.29 C13.1 150.11,88.75 153.33,88.75 C26.+ | C15.1 98.68,65.89 96.73,65.89 C28.+ | 113.92,20.8 C10.1 | C29.+ 112.61,20.8 113.92,20.8 | 26.29,5.56 27.43,6.7 C4.1 27.43,10.51 | IC7.20 23.17,25.3 v24.38,26.52 C6.1 | IC2.20 23.17,41.81 v24.38,43.03 C3.1

## Text on the board
Top: JP5: 1M MEM | JP8: ROM2 ROM1 | CS5 | CS4 | A18 | A17 | A16 | GND | VCC | TOP | RESET | 1 | TH2008 | VCC | CPU68K V3.2.1
Bottom: BOTTOM | CPU68K V3.2.1
Document: when set: | 2MB RAM | ROM2 | ROM1 | EXTERNAL MEM | /CS5 | /CS4 | =1 -> | =Axx -> | RESET | A18 | A17 | A16 | JP8: | (x=Jumper set) | ROM2 ROM1 eprom size | x x 64K | x 128K | x 256K | 512K